# EAGLE design cave (EAGLE 7.7.0)

## Sheet 1 of 5: General
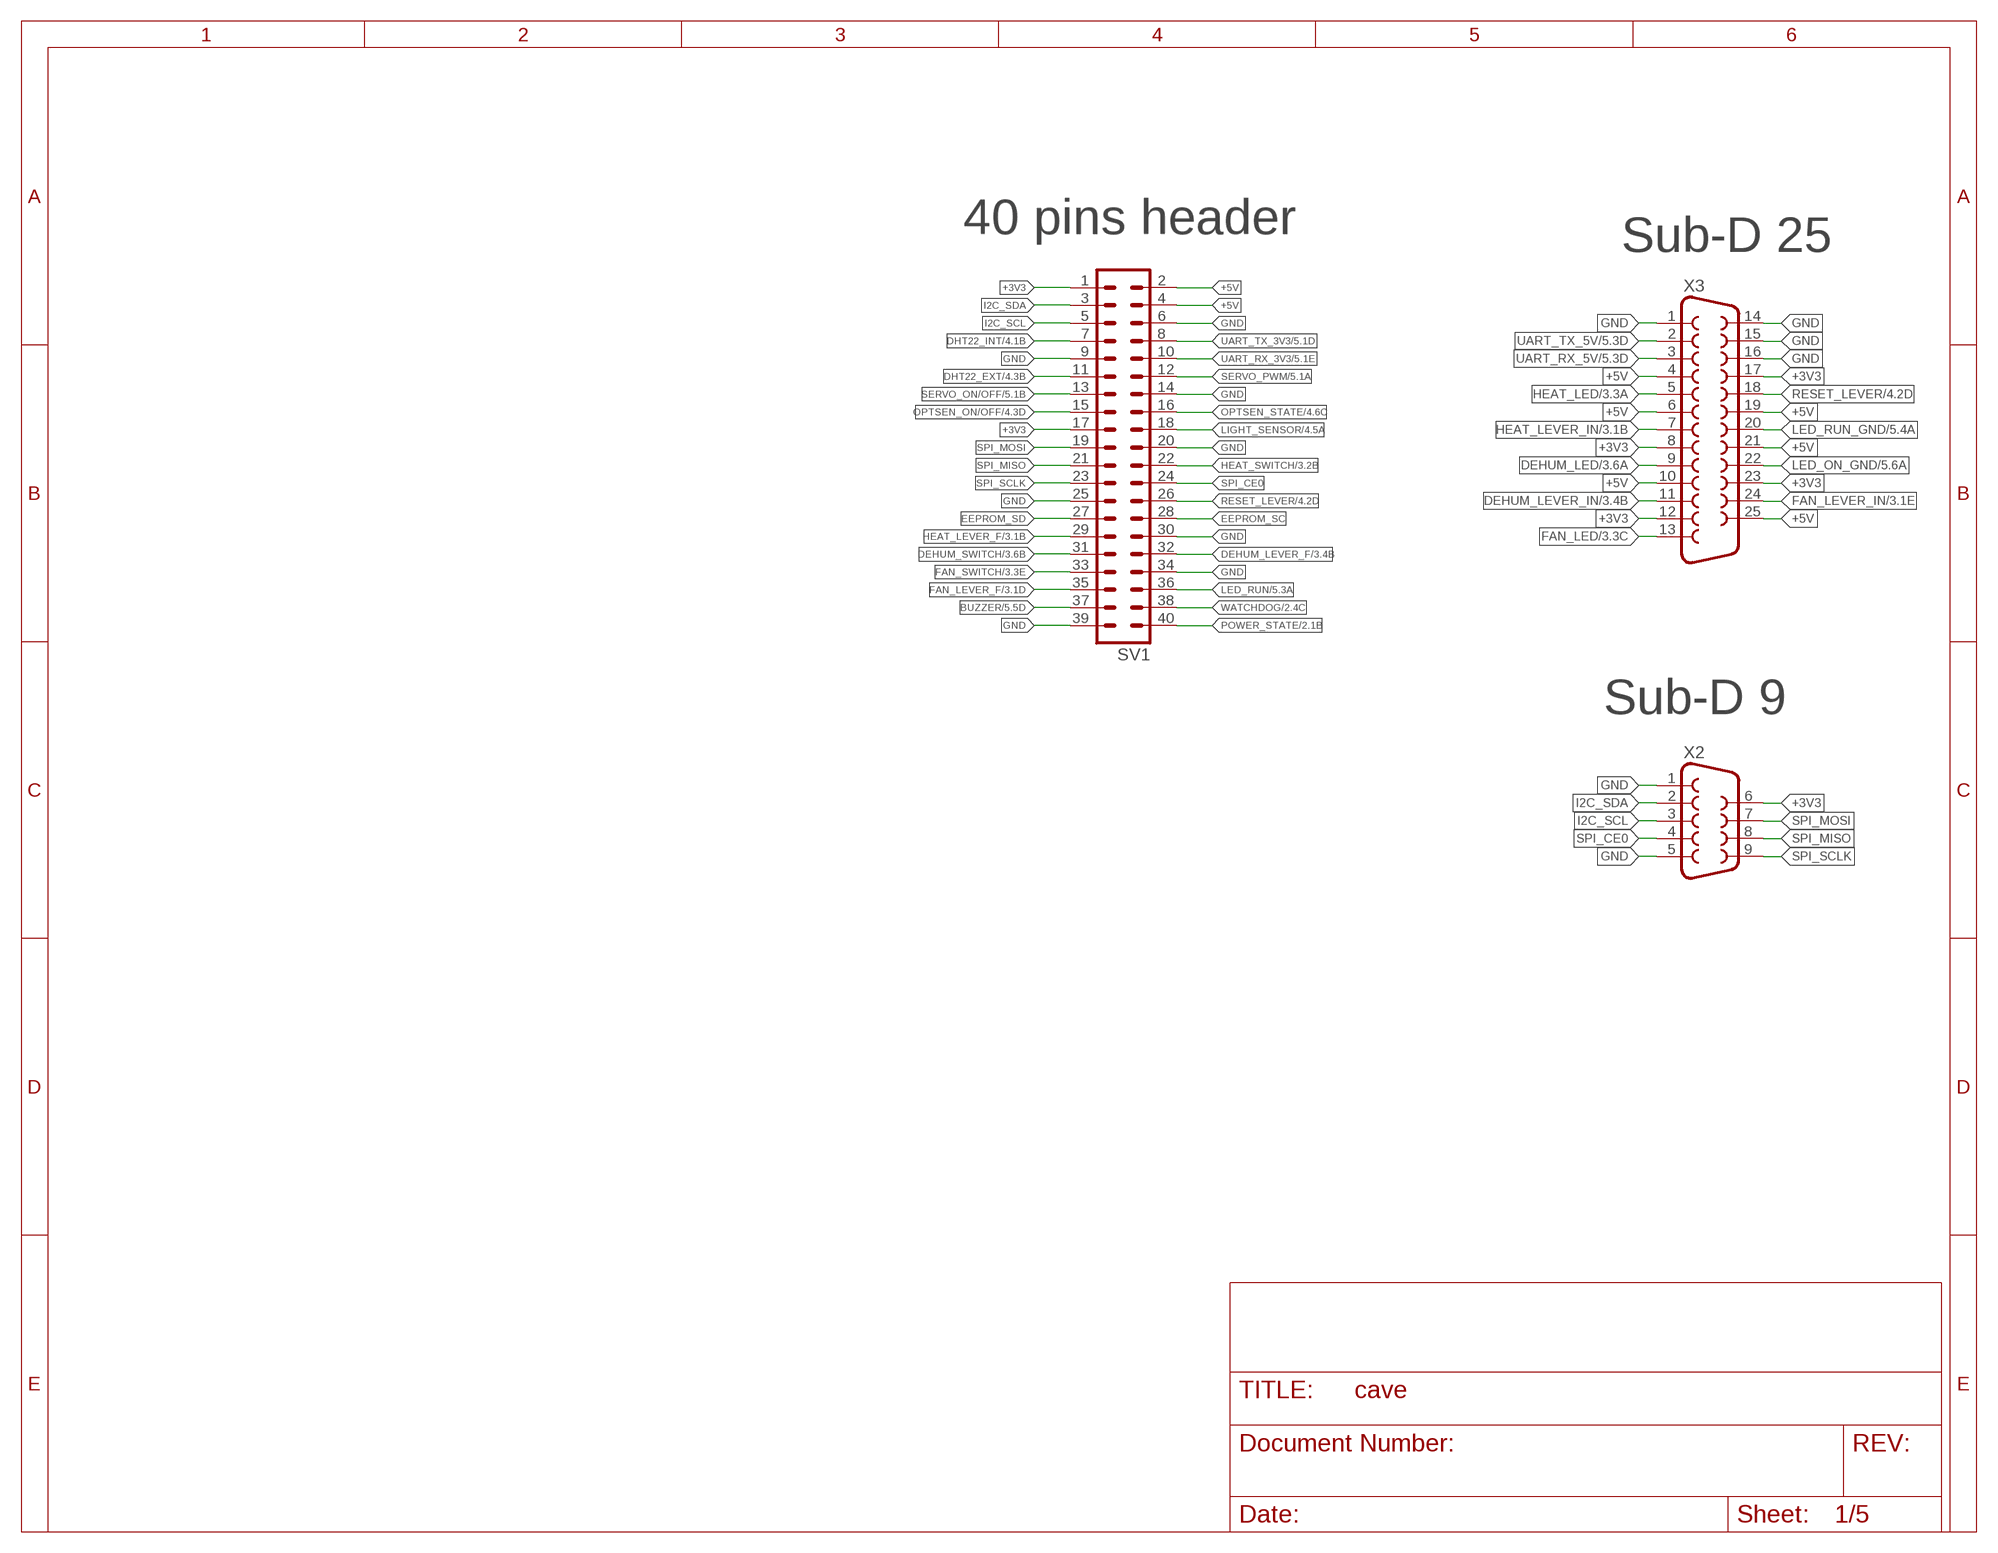
[diagram p0: schematic, sheet 1]

### Parts
SV1  MA20-2  [MA20-2]
X2  F09V  [F09V]
X3  F25V  [F25V]

### Nets
+3V3: SV1.1 SV1.17 X2.6 X3.8 X3.12 X3.17 X3.23 ; also sheet 4,5
+5V: SV1.2 SV1.4 X3.4 X3.6 X3.10 X3.19 X3.21 X3.25 ; also sheet 2,3,4,5
BUZZER: SV1.37 ; also sheet 5
DEHUM_LED: X3.9 ; also sheet 3
DEHUM_LEVER_F: SV1.32 ; also sheet 3
DEHUM_LEVER_IN: X3.11 ; also sheet 3
DEHUM_SWITCH: SV1.31 ; also sheet 3
DHT22_EXT: SV1.11 ; also sheet 4
DHT22_INT: SV1.7 ; also sheet 4
EEPROM_SC: SV1.28
EEPROM_SD: SV1.27
FAN_LED: X3.13 ; also sheet 3
FAN_LEVER_F: SV1.35 ; also sheet 3
FAN_LEVER_IN: X3.24 ; also sheet 3
FAN_SWITCH: SV1.33 ; also sheet 3
GND: SV1.6 SV1.9 SV1.14 SV1.20 SV1.25 SV1.30 SV1.34 SV1.39 X2.1 X2.5 X3.1 X3.14 X3.15 X3.16 ; also sheet 2,3,4,5
HEAT_LED: X3.5 ; also sheet 3
HEAT_LEVER_F: SV1.29 ; also sheet 3
HEAT_LEVER_IN: X3.7 ; also sheet 3
HEAT_SWITCH: SV1.22 ; also sheet 3
I2C_SCL: SV1.5 X2.3
I2C_SDA: SV1.3 X2.2
LED_ON_GND: X3.22 ; also sheet 5
LED_RUN: SV1.36 ; also sheet 5
LED_RUN_GND: X3.20 ; also sheet 5
LIGHT_SENSOR: SV1.18 ; also sheet 4
OPTSEN_ON/OFF: SV1.15 ; also sheet 4
OPTSEN_STATE: SV1.16 ; also sheet 4
POWER_STATE: SV1.40 ; also sheet 2
RESET_LEVER: SV1.26 X3.18 ; also sheet 4
SERVO_ON/OFF: SV1.13 ; also sheet 5
SERVO_PWM: SV1.12 ; also sheet 5
SPI_CE0: SV1.24 X2.4
SPI_MISO: SV1.21 X2.8
SPI_MOSI: SV1.19 X2.7
SPI_SCLK: SV1.23 X2.9
UART_RX_3V3: SV1.10 ; also sheet 5
UART_RX_5V: X3.3 ; also sheet 5
UART_TX_3V3: SV1.8 ; also sheet 5
UART_TX_5V: X3.2 ; also sheet 5
WATCHDOG: SV1.38 ; also sheet 2

### Notes on the sheet
- 40 pins header
- Sub-D 25
- Sub-D 9

## Sheet 2 of 5: Alim
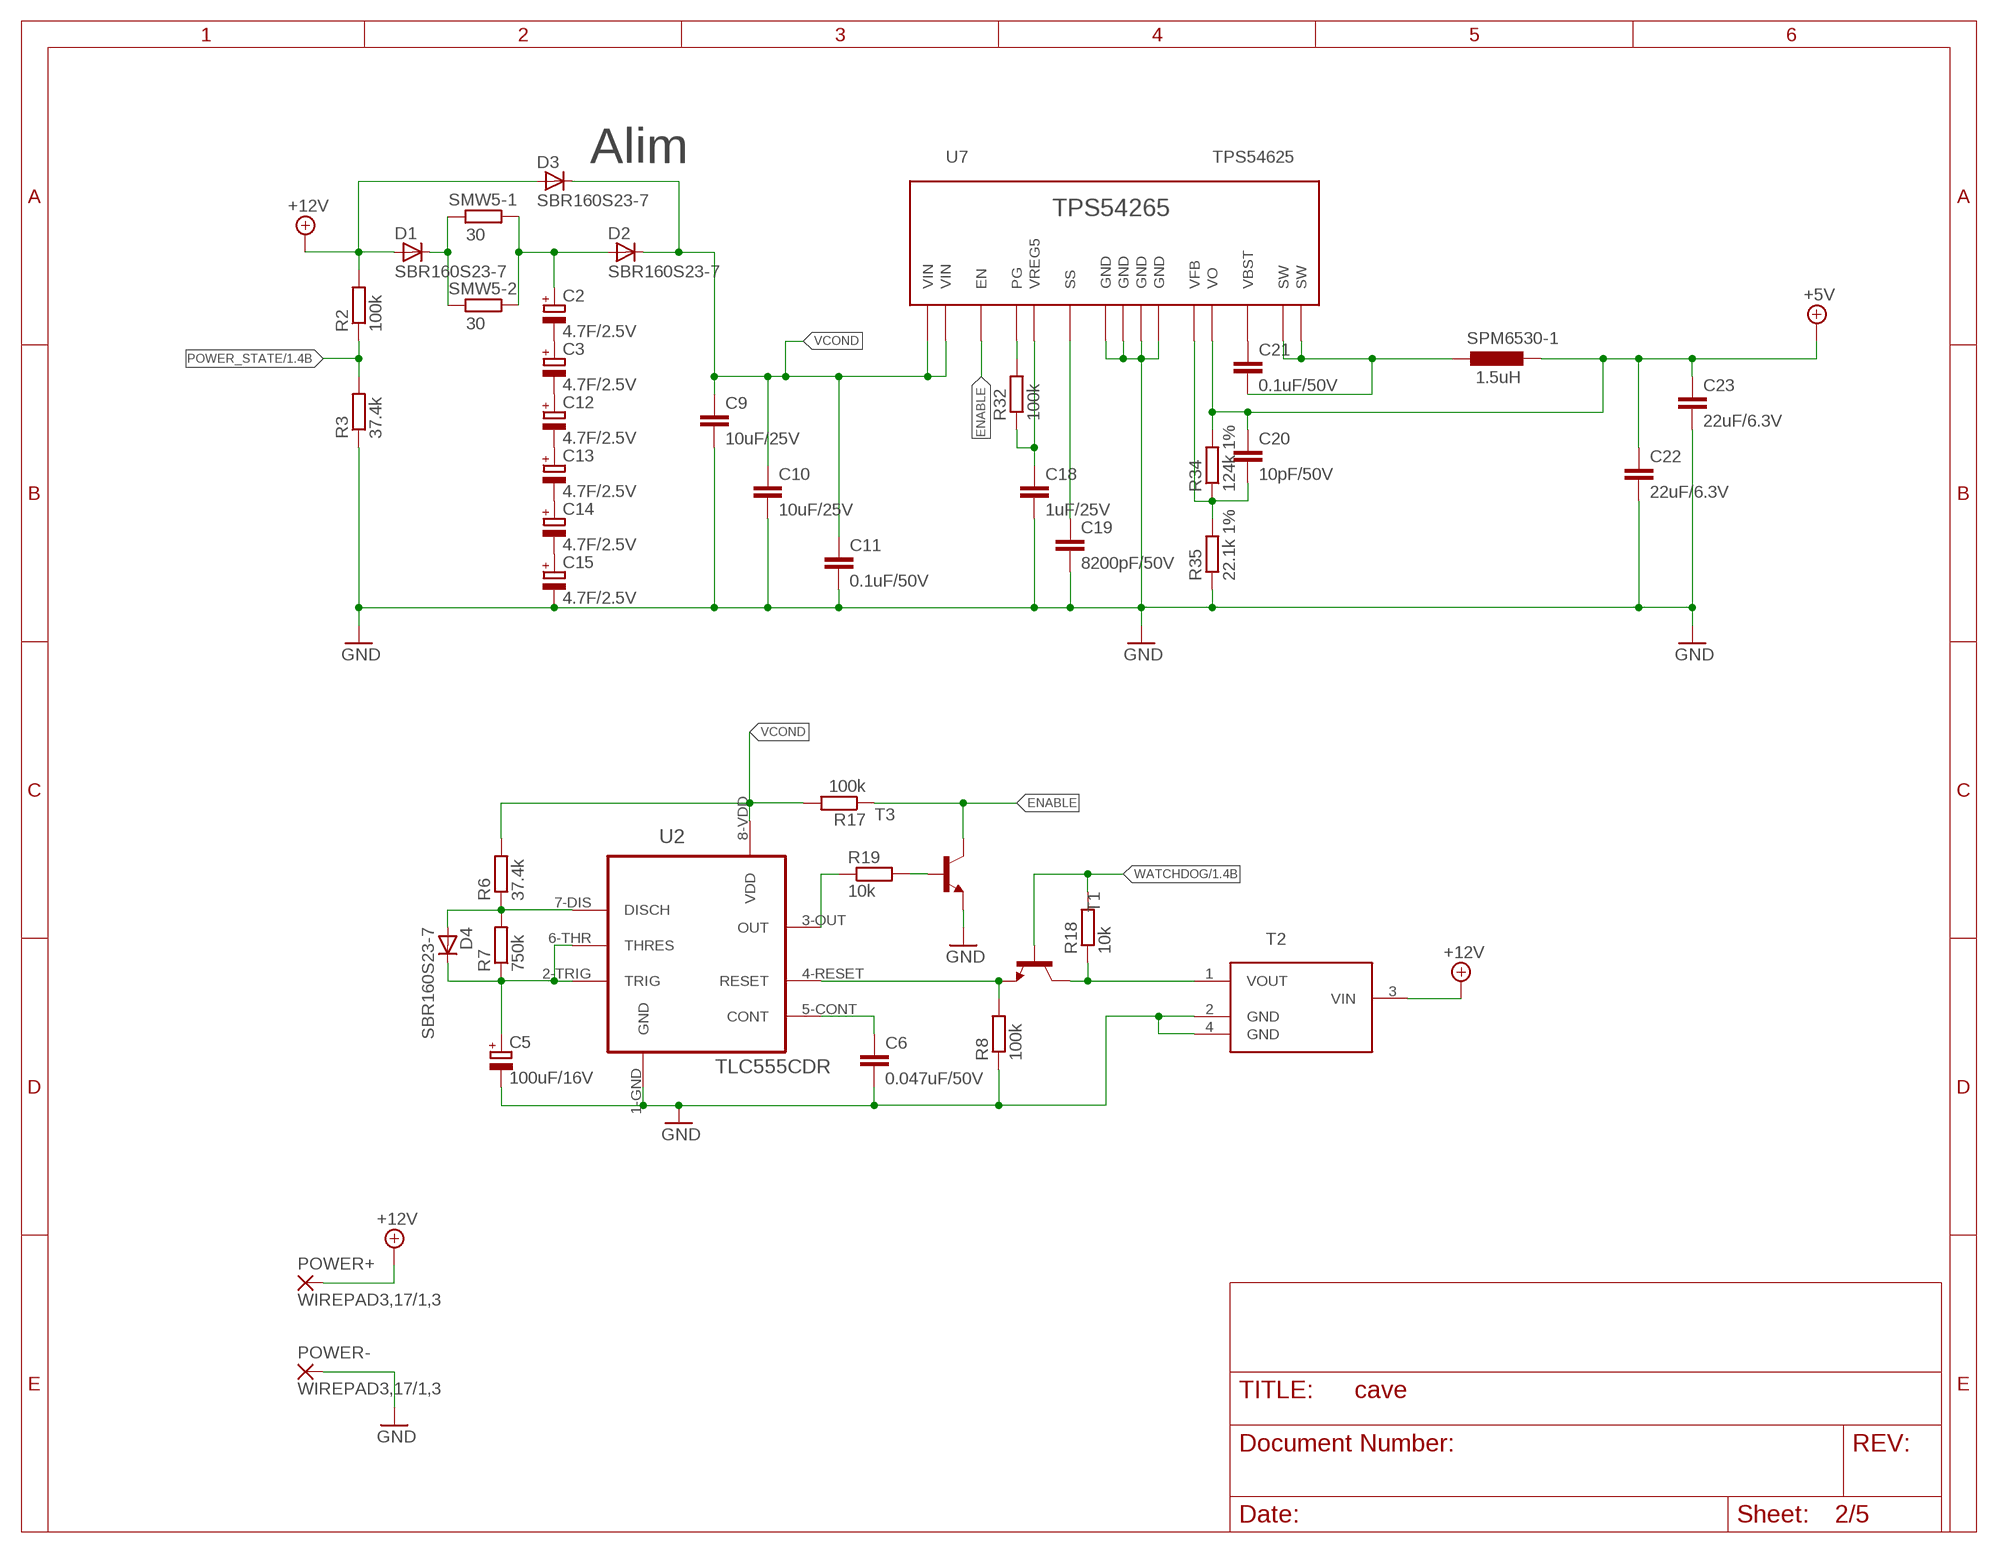
[diagram p1: schematic, sheet 2]

### Parts
C2  4.7F/2.5V  CPOL-EUE5-10.5  [E5-10,5]
C3  4.7F/2.5V  CPOL-EUE5-10.5  [E5-10,5]
C5  100uF/16V  CPOL-EUD/7343-31W  [D/7343-31W]
C6  0.047uF/50V  C-EUC0603  [C0603]
C9  10uF/25V  C-EUC0805  [C0805]
C10  10uF/25V  C-EUC0805  [C0805]
C11  0.1uF/50V  C-EUC0603  [C0603]
C12  4.7F/2.5V  CPOL-EUE5-10.5  [E5-10,5]
C13  4.7F/2.5V  CPOL-EUE5-10.5  [E5-10,5]
C14  4.7F/2.5V  CPOL-EUE5-10.5  [E5-10,5]
C15  4.7F/2.5V  CPOL-EUE5-10.5  [E5-10,5]
C18  1uF/25V  C-EUC0603  [C0603]
C19  8200pF/50V  C-EUC0603  [C0603]
C20  10pF/50V  C-EUC0603  [C0603]
C21  0.1uF/50V  C-EUC0603  [C0603]
C22  22uF/6.3V  C-EUC0805  [C0805]
C23  22uF/6.3V  C-EUC0805  [C0805]
D1  SBR160S23-7  D-A1-C3  [SOT23]
D2  SBR160S23-7  D-A1-C3  [SOT23]
D3  SBR160S23-7  D-A1-C3  [SOT23]
D4  SBR160S23-7  D-A1-C3  [SOT23]
POWER+  WIREPAD3,17/1,3  [3,17/1,3]
POWER-  WIREPAD3,17/1,3  [3,17/1,3]
R2  100k  R-EU_R0603  [R0603]
R3  37.4k  R-EU_R0603  [R0603]
R6  37.4k  R-EU_R0603  [R0603]
R7  750k  R-EU_R0603  [R0603]
R8  100k  R-EU_R0603  [R0603]
R17  100k  R-EU_R0603  [R0603]
R18  10k  R-EU_R0603  [R0603]
R19  10k  R-EU_R0603  [R0603]
R32  100k  R-EU_R0603  [R0603]
R34  124k 1%  R-EU_R0603  [R0603]
R35  22.1k 1%  R-EU_R0603  [R0603]
SMW5-1  30  SMW530RJT  [SM_5]
SMW5-2  30  SMW530RJT  [SM_5]
SPM6530-1  1.5uH  SPM6530  [6530]
T1  MMBT2369LT1-NPN-SOT23-BEC  [SOT23-BEC]
T2  L78L33ACUTR  [SOT150P400X160-4N]
T3  MMBT2369LT1-NPN-SOT23-BEC  [SOT23-BEC]
U2  TLC555CDR  [SOIC127P600X175-8N]
U7  TPS54625  [HTSSOP-14]

### Nets
+5V: C20.1 C22.1 C23.1 R34.2 SPM6530-1.P$2 U7.P$1(VO) ; also sheet 1,3,4,5
+12V: D1.1(A) D3.1(A) POWER+.1(P) R2.2 T2.3(VIN) ; also sheet 3,5
ENABLE: R17.1 T3.C U7.P$7(EN)
GND: C5.- C6.2 C9.2 C10.2 C11.2 C15.- C18.2 C19.2 C22.2 C23.2 POWER-.1(P) R3.1 R8.1 R35.1 T2.2(GND) T2.4(GND) T3.E U2.1-GND(GND) U7.P$5(GND) U7.P$8(GND) U7.P$9(GND) U7.P$15(GND) ; also sheet 1,3,4,5
N$1: C2.+ D2.1(A) SMW5-1.P$2 SMW5-2.P$2
N$2: C2.- C3.+
N$3: C3.- C12.+
N$4: D1.3(C) SMW5-1.P$1 SMW5-2.P$1
N$5: D4.1(A) R6.1 R7.2 U2.7-DIS(DISCH)
N$6: C5.+ D4.3(C) R7.1 U2.2-TRIG(TRIG) U2.6-THR(THRES)
N$8: C12.- C13.+
N$9: C6.1 U2.5-CONT(CONT)
N$11: R18.1 T1.C T2.1(VOUT)
N$12: R8.2 T1.E U2.4-RESET(RESET)
N$16: R19.1 U2.3-OUT(OUT)
N$17: R19.2 T3.B
N$18: C13.- C14.+
N$19: C14.- C15.+
N$28: C18.1 R32.1 U7.P$3(VREG5)
N$30: R32.2 U7.P$6(PG)
N$31: C19.1 U7.P$4(SS)
N$34: C20.2 R34.1 R35.2 U7.P$2(VFB)
N$35: C21.1 U7.P$12(VBST)
N$36: C21.2 SPM6530-1.P$1 U7.P$10(SW) U7.P$11(SW)
POWER_STATE: R2.1 R3.2 ; also sheet 1
VCOND: C9.1 C10.1 C11.1 D2.3(C) D3.3(C) R6.2 R17.2 U2.8-VDD(VDD) U7.P$13(VIN) U7.P$14(VIN)
WATCHDOG: R18.2 T1.B ; also sheet 1

### Notes on the sheet
- Alim

## Sheet 3 of 5: Switches
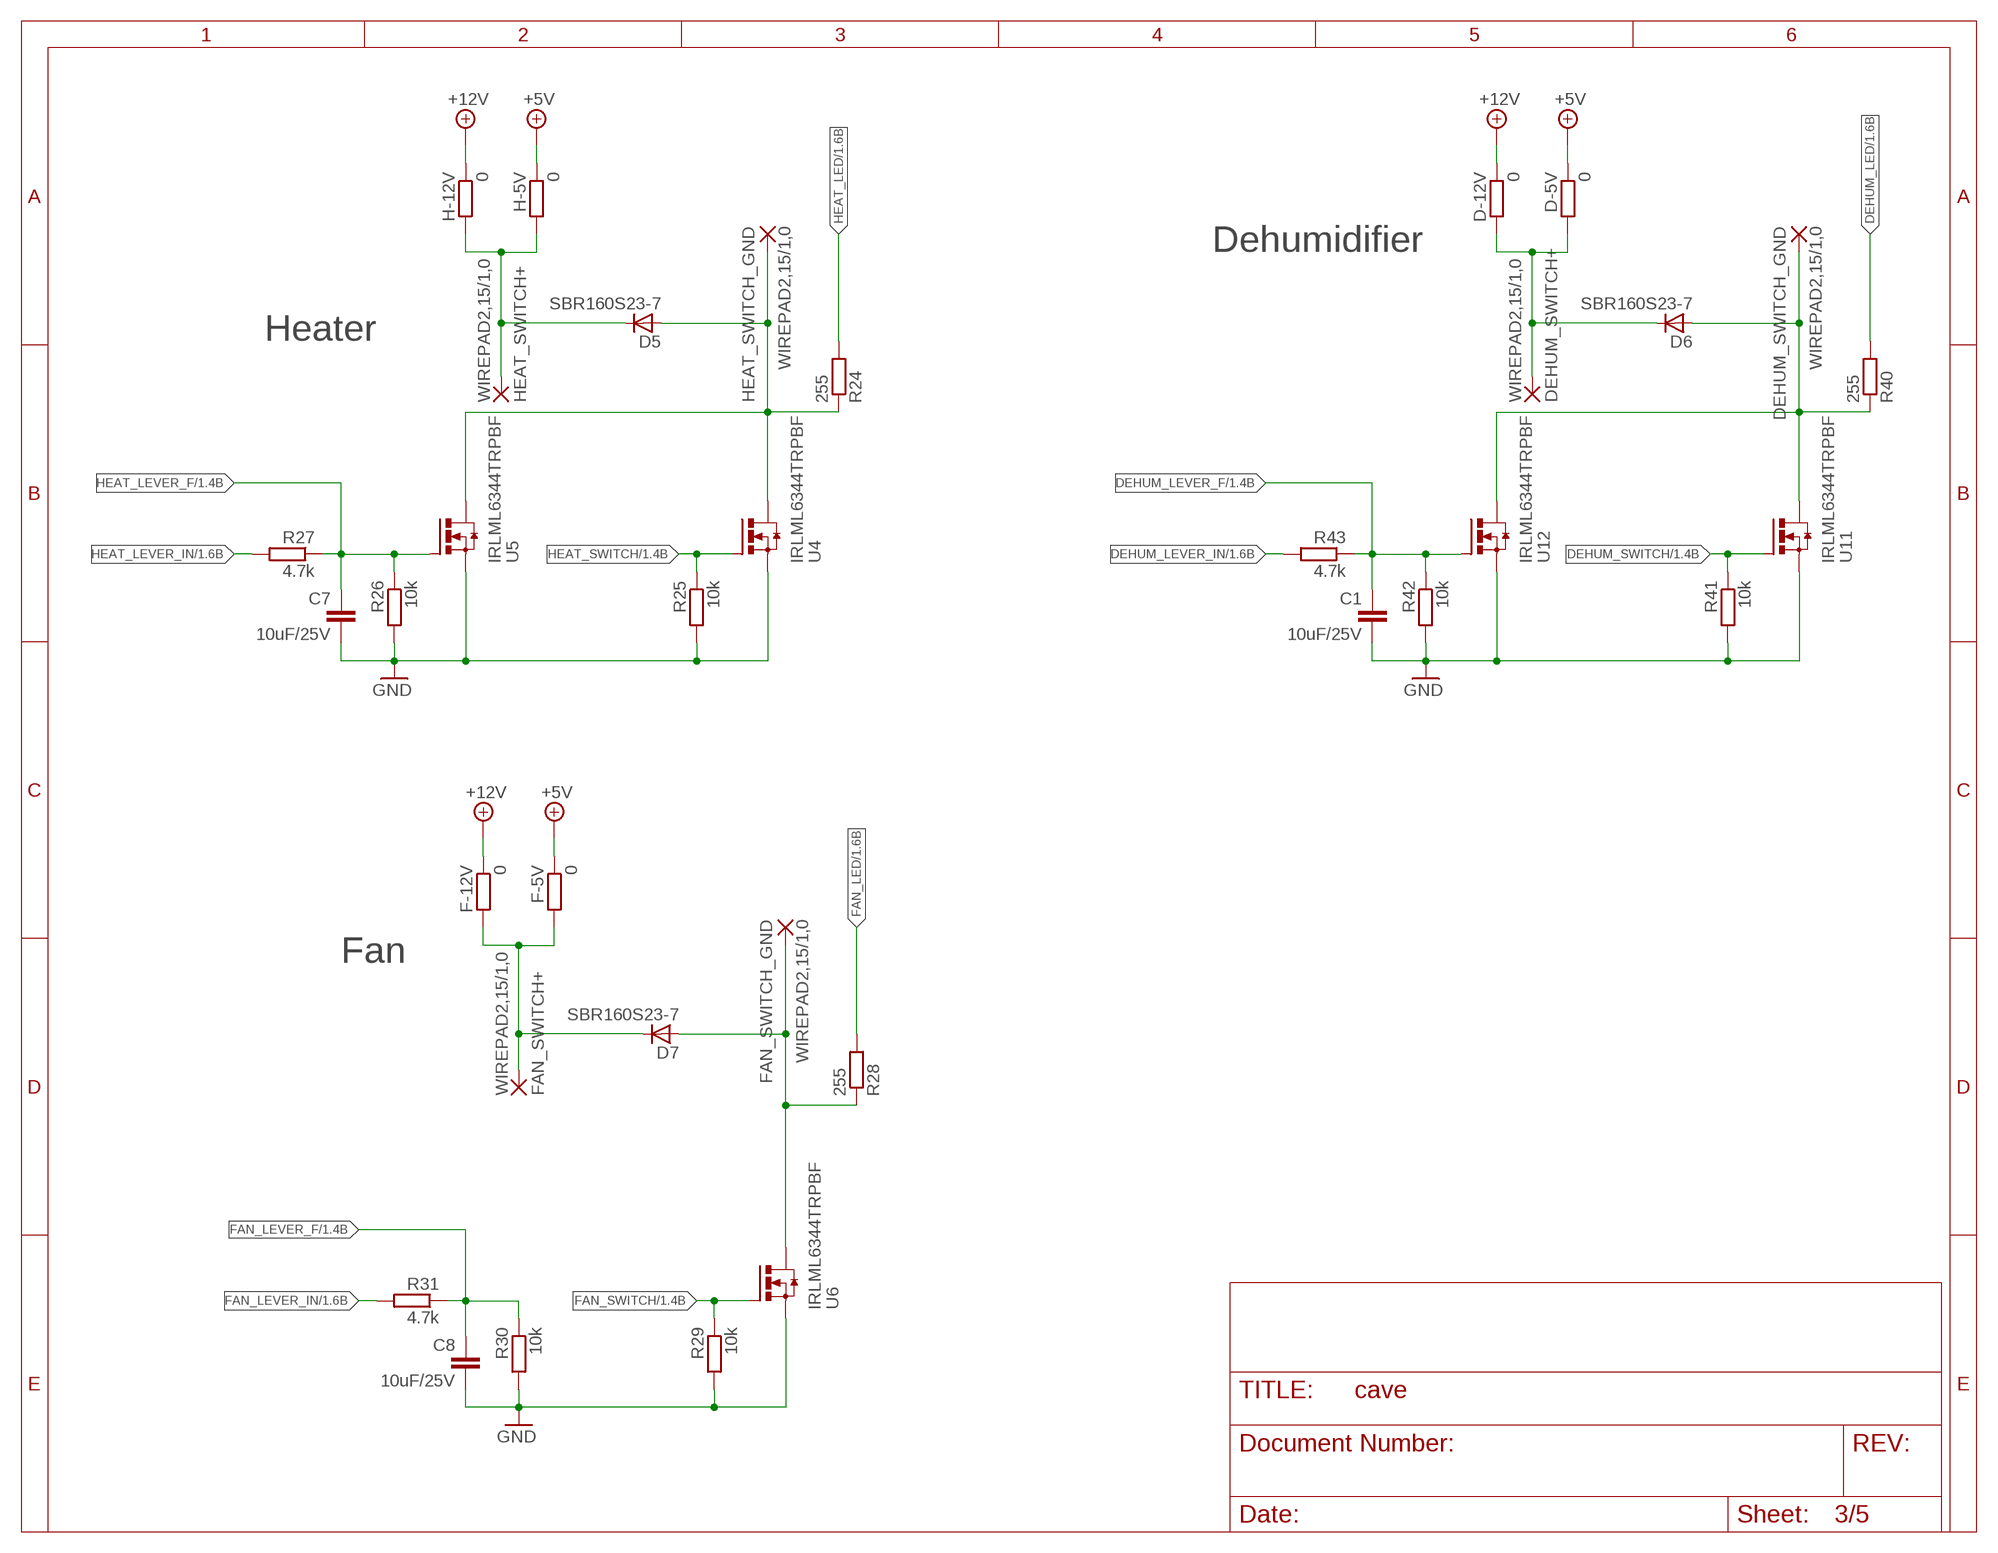
[diagram p2: schematic, sheet 3]

### Parts
C1  10uF/25V  C-EUC0805  [C0805]
C7  10uF/25V  C-EUC0805  [C0805]
C8  10uF/25V  C-EUC0805  [C0805]
D5  SBR160S23-7  D-A1-C3  [SOT23]
D6  SBR160S23-7  D-A1-C3  [SOT23]
D7  SBR160S23-7  D-A1-C3  [SOT23]
D-5V  0  R-EU_R0805  [R0805]
D-12V  0  R-EU_R0805  [R0805]
DEHUM_SWITCH+  WIREPAD2,15/1,0  [2,15/1,0]
DEHUM_SWITCH_GND  WIREPAD2,15/1,0  [2,15/1,0]
F-5V  0  R-EU_R0805  [R0805]
F-12V  0  R-EU_R0805  [R0805]
FAN_SWITCH+  WIREPAD2,15/1,0  [2,15/1,0]
FAN_SWITCH_GND  WIREPAD2,15/1,0  [2,15/1,0]
H-5V  0  R-EU_R0805  [R0805]
H-12V  0  R-EU_R0805  [R0805]
HEAT_SWITCH+  WIREPAD2,15/1,0  [2,15/1,0]
HEAT_SWITCH_GND  WIREPAD2,15/1,0  [2,15/1,0]
R24  255  R-EU_R0805  [R0805]
R25  10k  R-EU_R0603  [R0603]
R26  10k  R-EU_R0603  [R0603]
R27  4.7k  R-EU_R0603  [R0603]
R28  255  R-EU_R0805  [R0805]
R29  10k  R-EU_R0603  [R0603]
R30  10k  R-EU_R0603  [R0603]
R31  4.7k  R-EU_R0603  [R0603]
R40  255  R-EU_R0805  [R0805]
R41  10k  R-EU_R0603  [R0603]
R42  10k  R-EU_R0603  [R0603]
R43  4.7k  R-EU_R0603  [R0603]
U4  IRLML6344TRPBF  [SOT95P240X112-3N]
U5  IRLML6344TRPBF  [SOT95P240X112-3N]
U6  IRLML6344TRPBF  [SOT95P240X112-3N]
U11  IRLML6344TRPBF  [SOT95P240X112-3N]
U12  IRLML6344TRPBF  [SOT95P240X112-3N]

### Nets
+5V: D-5V.1 F-5V.1 H-5V.1 ; also sheet 1,2,4,5
+12V: D-12V.1 F-12V.1 H-12V.1 ; also sheet 2,5
DEHUM_GND: D6.1(A) DEHUM_SWITCH_GND.1(P) R40.1 U11.3(D) U12.3(D)
DEHUM_LED: R40.2 ; also sheet 1
DEHUM_LEVER_F: C1.1 R42.1 R43.1 U12.1(G) ; also sheet 1
DEHUM_LEVER_IN: R43.2 ; also sheet 1
DEHUM_SWITCH: R41.1 U11.1(G) ; also sheet 1
FAN_GND: D7.1(A) FAN_SWITCH_GND.1(P) R28.1 U6.3(D)
FAN_LED: R28.2 ; also sheet 1
FAN_LEVER_F: C8.1 R30.1 R31.1 ; also sheet 1
FAN_LEVER_IN: R31.2 ; also sheet 1
FAN_SWITCH: R29.1 U6.1(G) ; also sheet 1
GND: C1.2 C7.2 C8.2 R25.2 R26.2 R29.2 R30.2 R41.2 R42.2 U4.2(S) U5.2(S) U6.2(S) U11.2(S) U12.2(S) ; also sheet 1,2,4,5
HEAT_GND: D5.1(A) HEAT_SWITCH_GND.1(P) R24.1 U4.3(D) U5.3(D)
HEAT_LED: R24.2 ; also sheet 1
HEAT_LEVER_F: C7.1 R26.1 R27.1 U5.1(G) ; also sheet 1
HEAT_LEVER_IN: R27.2 ; also sheet 1
HEAT_SWITCH: R25.1 U4.1(G) ; also sheet 1
N$22: D7.3(C) F-5V.2 F-12V.2 FAN_SWITCH+.1(P)
N$26: D5.3(C) H-5V.2 H-12V.2 HEAT_SWITCH+.1(P)
N$27: D6.3(C) D-5V.2 D-12V.2 DEHUM_SWITCH+.1(P)

### Notes on the sheet
- Dehumidifier
- Heater
- Fan

## Sheet 4 of 5: Sensors
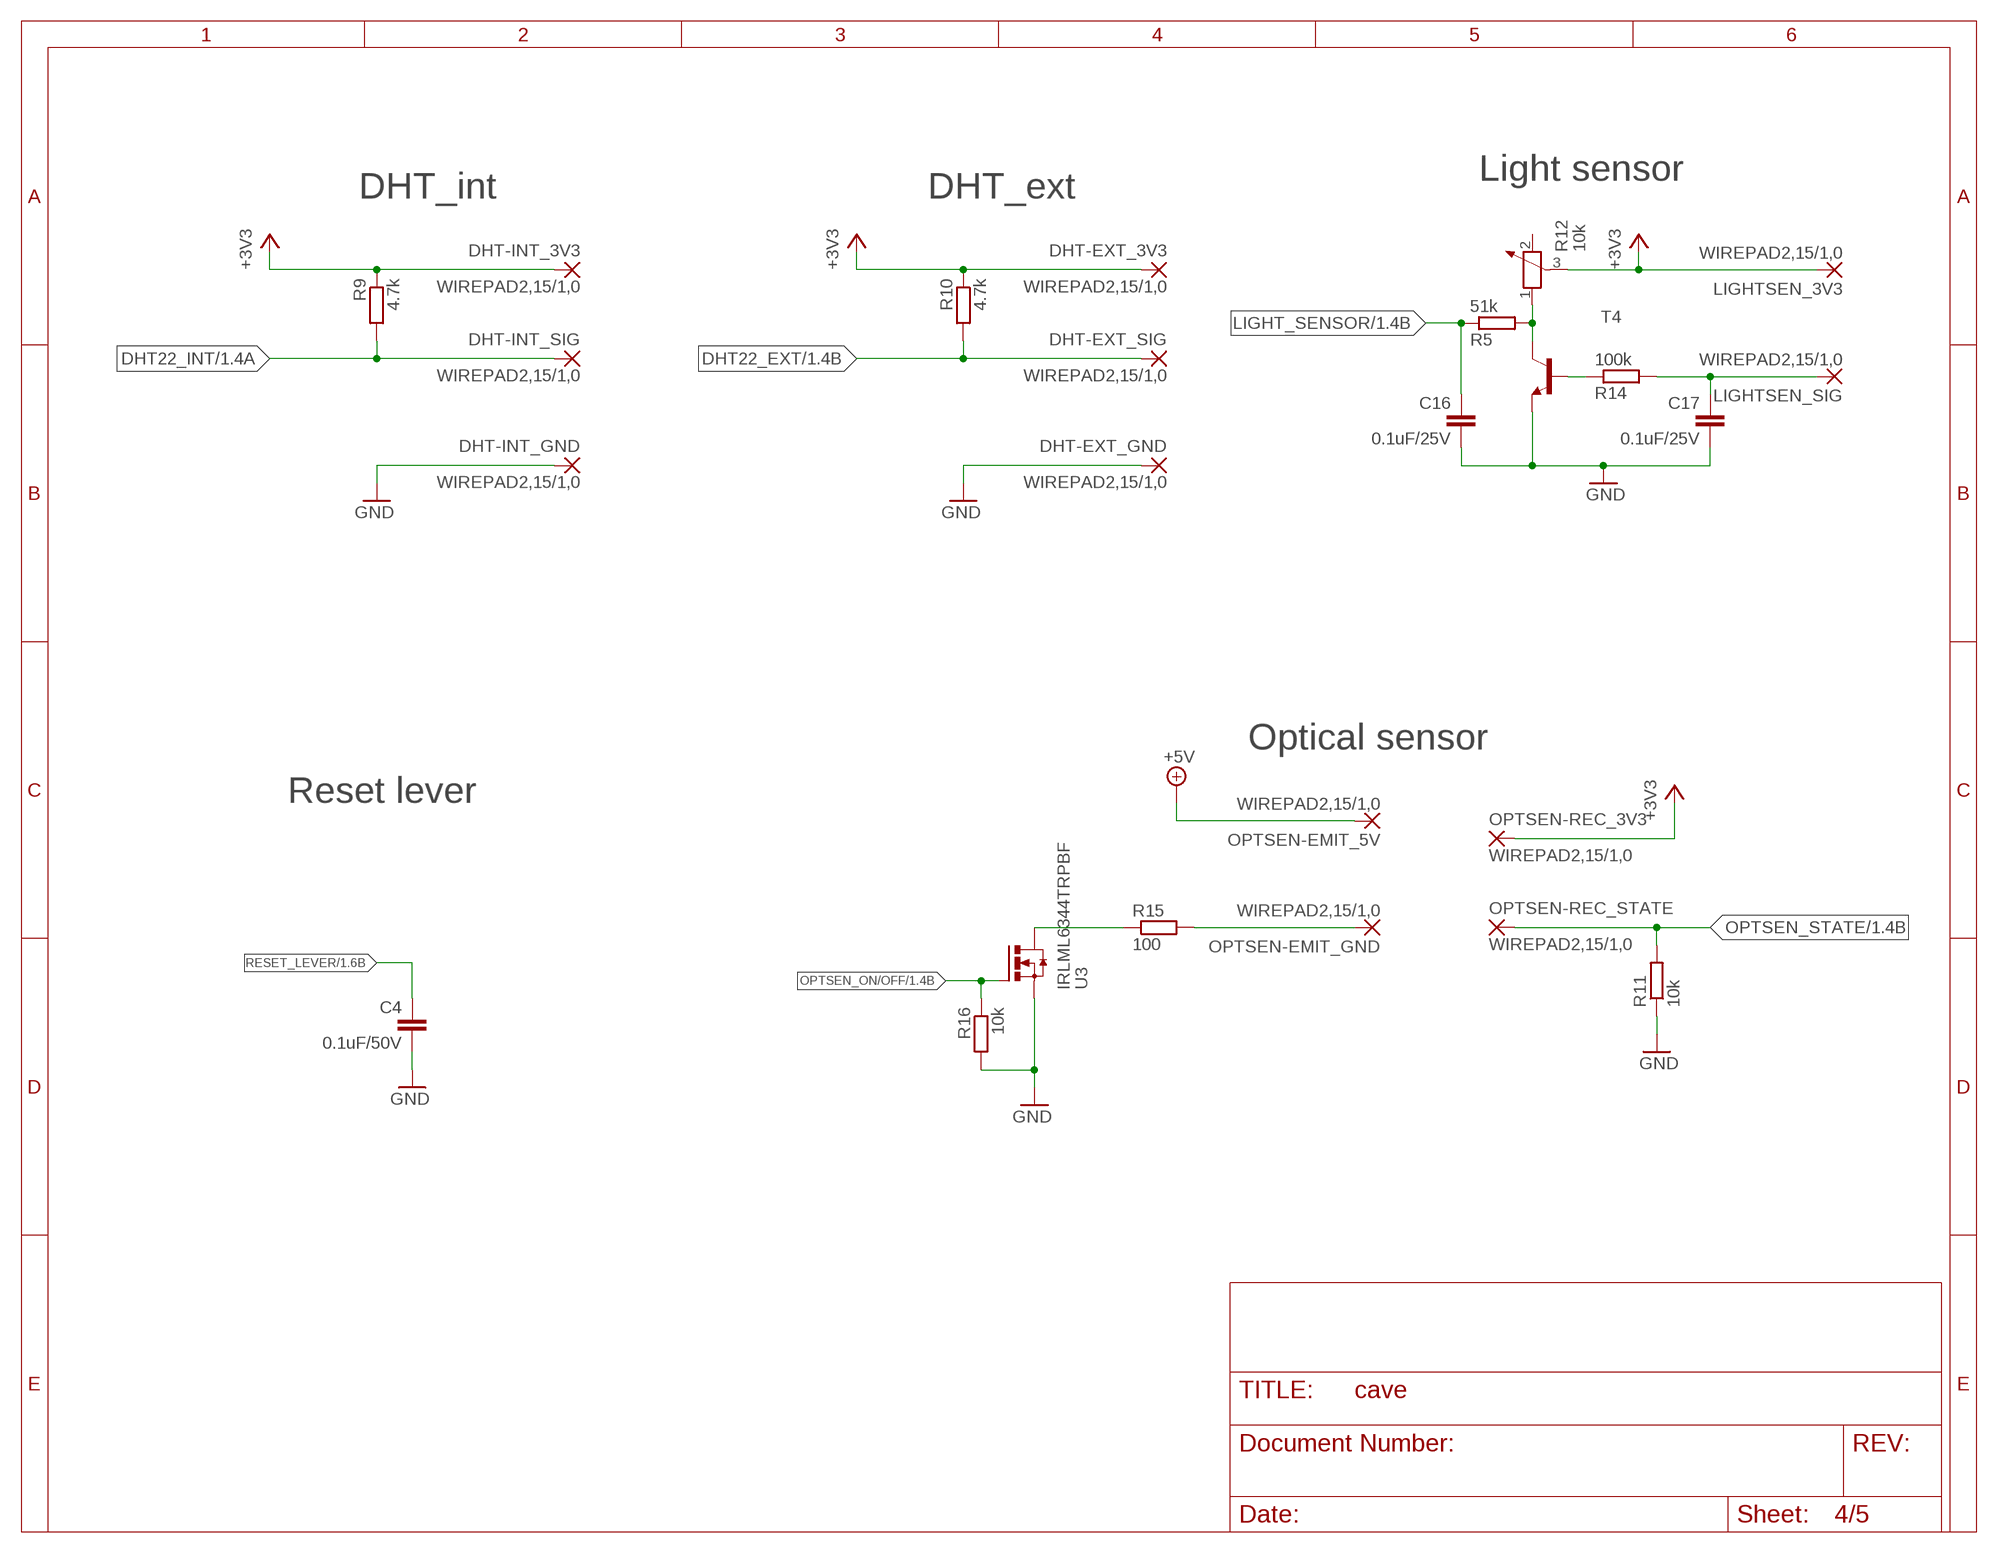
[diagram p3: schematic, sheet 4]

### Parts
C4  0.1uF/50V  C-EUC0603  [C0603]
C16  0.1uF/25V  C-EUC0603  [C0603]
C17  0.1uF/25V  C-EUC0603  [C0603]
DHT-EXT_3V3  WIREPAD2,15/1,0  [2,15/1,0]
DHT-EXT_GND  WIREPAD2,15/1,0  [2,15/1,0]
DHT-EXT_SIG  WIREPAD2,15/1,0  [2,15/1,0]
DHT-INT_3V3  WIREPAD2,15/1,0  [2,15/1,0]
DHT-INT_GND  WIREPAD2,15/1,0  [2,15/1,0]
DHT-INT_SIG  WIREPAD2,15/1,0  [2,15/1,0]
LIGHTSEN_3V3  WIREPAD2,15/1,0  [2,15/1,0]
LIGHTSEN_SIG  WIREPAD2,15/1,0  [2,15/1,0]
OPTSEN-EMIT_5V  WIREPAD2,15/1,0  [2,15/1,0]
OPTSEN-EMIT_GND  WIREPAD2,15/1,0  [2,15/1,0]
OPTSEN-REC_3V3  WIREPAD2,15/1,0  [2,15/1,0]
OPTSEN-REC_STATE  WIREPAD2,15/1,0  [2,15/1,0]
R5  51k  R-EU_R0603  [R0603]
R9  4.7k  R-EU_R0603  [R0603]
R10  4.7k  R-EU_R0603  [R0603]
R11  10k  R-EU_R0603  [R0603]
R12  10k  POTENTIOMETER_PT_SPIN  [PT-SPIN]
R14  100k  R-EU_R0603  [R0603]
R15  100  R-EU_R0805  [R0805]
R16  10k  R-EU_R0603  [R0603]
T4  MMBT2369LT1-NPN-SOT23-BEC  [SOT23-BEC]
U3  IRLML6344TRPBF  [SOT95P240X112-3N]

### Nets
+3V3: DHT-EXT_3V3.1(P) DHT-INT_3V3.1(P) LIGHTSEN_3V3.1(P) OPTSEN-REC_3V3.1(P) R9.1 R10.1 R12.3 ; also sheet 1,5
+5V: OPTSEN-EMIT_5V.1(P) ; also sheet 1,2,3,5
DHT22_EXT: DHT-EXT_SIG.1(P) R10.2 ; also sheet 1
DHT22_INT: DHT-INT_SIG.1(P) R9.2 ; also sheet 1
GND: C4.2 C16.2 C17.2 DHT-EXT_GND.1(P) DHT-INT_GND.1(P) R11.1 R16.2 T4.E U3.2(S) ; also sheet 1,2,3,5
LIGHT_SENSOR: C16.1 R5.1 ; also sheet 1
LIGHT_SENSOR_UNFILTERED: R5.2 R12.1 T4.C
N$14: OPTSEN-EMIT_GND.1(P) R15.2
N$15: R15.1 U3.3(D)
N$20: R14.1 T4.B
N$21: C17.1 LIGHTSEN_SIG.1(P) R14.2
OPTSEN_ON/OFF: R16.1 U3.1(G) ; also sheet 1
OPTSEN_STATE: OPTSEN-REC_STATE.1(P) R11.2 ; also sheet 1
RESET_LEVER: C4.1 ; also sheet 1
Unconnected: R12.2

### Notes on the sheet
- Light sensor
- DHT_int | DHT_ext
- Optical sensor
- Reset lever

## Sheet 5 of 5: Outputs
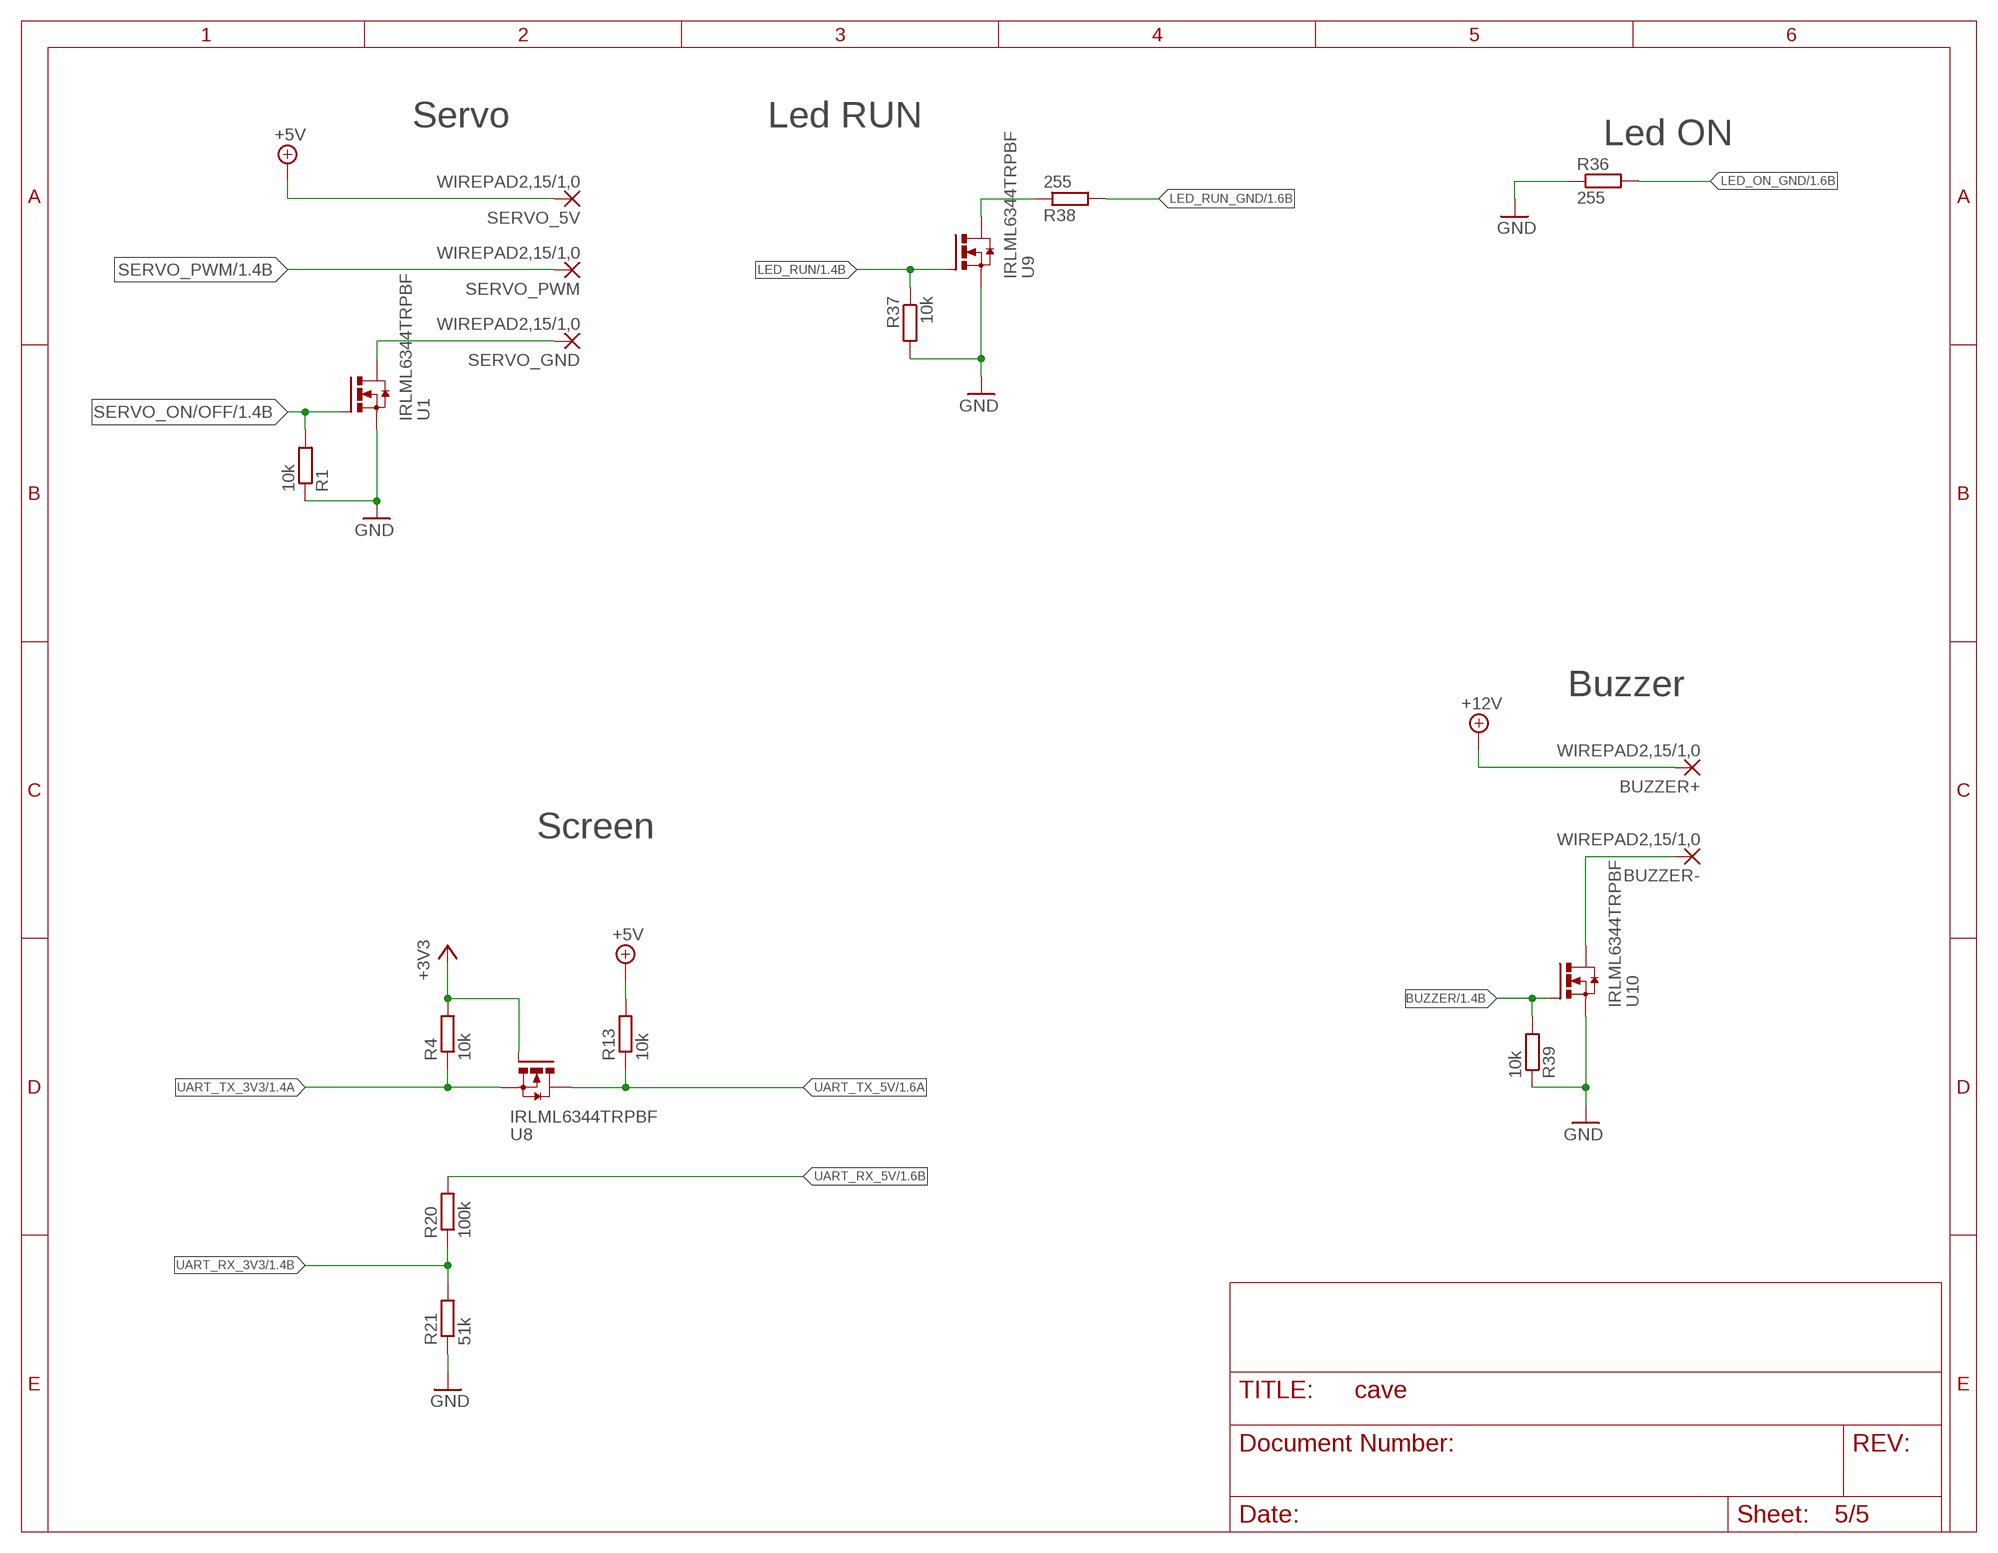
[diagram p4: schematic, sheet 5]

### Parts
BUZZER+  WIREPAD2,15/1,0  [2,15/1,0]
BUZZER-  WIREPAD2,15/1,0  [2,15/1,0]
R1  10k  R-EU_R0603  [R0603]
R4  10k  R-EU_R0603  [R0603]
R13  10k  R-EU_R0603  [R0603]
R20  100k  R-EU_R0603  [R0603]
R21  51k  R-EU_R0603  [R0603]
R36  255  R-EU_R0805  [R0805]
R37  10k  R-EU_R0603  [R0603]
R38  255  R-EU_R0805  [R0805]
R39  10k  R-EU_R0603  [R0603]
SERVO_5V  WIREPAD2,15/1,0  [2,15/1,0]
SERVO_GND  WIREPAD2,15/1,0  [2,15/1,0]
SERVO_PWM  WIREPAD2,15/1,0  [2,15/1,0]
U1  IRLML6344TRPBF  [SOT95P240X112-3N]
U8  IRLML6344TRPBF  [SOT95P240X112-3N]
U9  IRLML6344TRPBF  [SOT95P240X112-3N]
U10  IRLML6344TRPBF  [SOT95P240X112-3N]

### Nets
+3V3: R4.2 U8.1(G) ; also sheet 1,4
+5V: R13.2 SERVO_5V.1(P) ; also sheet 1,2,3,4
+12V: BUZZER+.1(P) ; also sheet 2,3
BUZZER: R39.2 U10.1(G) ; also sheet 1
GND: R1.1 R21.1 R36.1 R37.2 R39.1 U1.2(S) U9.2(S) U10.2(S) ; also sheet 1,2,3,4
LED_ON_GND: R36.2 ; also sheet 1
LED_RUN: R37.1 U9.1(G) ; also sheet 1
LED_RUN_GND: R38.2 ; also sheet 1
N$7: SERVO_GND.1(P) U1.3(D)
N$10: BUZZER-.1(P) U10.3(D)
N$25: R38.1 U9.3(D)
SERVO_ON/OFF: R1.2 U1.1(G) ; also sheet 1
SERVO_PWM: SERVO_PWM.1(P) ; also sheet 1
UART_RX_3V3: R20.1 R21.2 ; also sheet 1
UART_RX_5V: R20.2 ; also sheet 1
UART_TX_3V3: R4.1 U8.2(S) ; also sheet 1
UART_TX_5V: R13.1 U8.3(D) ; also sheet 1

### Notes on the sheet
- Servo | Led RUN
- Led ON
- Buzzer
- Screen

## Library data of the parts
BUZZER+ BUZZER- DEHUM_SWITCH+ DEHUM_SWITCH_GND DHT-EXT_3V3 DHT-EXT_GND DHT-EXT_SIG DHT-INT_3V3 DHT-INT_GND DHT-INT_SIG FAN_SWITCH+ FAN_SWITCH_GND HEAT_SWITCH+ HEAT_SWITCH_GND LIGHTSEN_3V3 LIGHTSEN_SIG OPTSEN-EMIT_5V OPTSEN-EMIT_GND OPTSEN-REC_3V3 OPTSEN-REC_STATE POWER+ POWER- SERVO_5V SERVO_GND SERVO_PWM = wirepad:WIREPAD: Wire PAD connect wire on PCB
C1 C4 C6-C11 C16-C23 = rcl:C-EU: CAPACITOR, European symbol
C2 C3 C12-C15 = rcl:CPOL-EU: POLARIZED CAPACITOR, European symbol
C5 = resistor:CPOL-EU: POLARIZED CAPACITOR, European symbol
D1-D7 = semicon-smd-ipc:D-: DIODE unfilled
D-5V D-12V F-5V F-12V H-5V H-12V R1-R11 R13-R21 R24-R32 R34-R43 = rcl:R-EU_: RESISTOR, European symbol
R12 = rcl:POTENTIOMETER_: Potentiometer
SMW5-1 SMW5-2 = SMW:SMW530RJT
SPM6530-1 = SPM_inductor:SPM6530
SV1 = HE_254:MA20-2: PIN HEADER; OC_FARNELL: unknown; OC_NEWARK: unknown
T1 T3 T4 = transistor:*-NPN-: NPN Transistror BF959 corrected 2008.03.06
T2 = STM-STM8S003_L78LxxUTR:L78L: Positive voltage regulators(Output current up to 100 mA and Output voltages of 3.3; 5; 6; 8; 9; 10; 12; 15; 18;24 V); MPN: L78L33ACUTR; OC_FARNELL: 2253467; OC_NEWARK: 89K1361; PACKAGE: SOT-89; SUPPLIER: STMicroelectronics
U1 U3-U6 U8-U12 = transistor-power:IRLML6344TRPBF: Power MOSFET; MPN: IRLML6344TRPBF; OC_FARNELL: 1857299; OC_NEWARK: 25T5501; PACKAGE: SOT-23-3; SUPPLIER: INTERNATIONAL RECTIFIER
U2 = TLC555CDR:TLC555CDR: TIMER; MPN: TLC555CDR; OC_FARNELL: 8454426; OC_NEWARK: 35C2153; PACKAGE: SOIC-8; SUPPLIER: TI
U7 = TPS54625:TPS54625
X2 = con-subd:F09: SUB-D; OC_FARNELL: unknown; OC_NEWARK: unknown
X3 = con-subd:F25: SUB-D; OC_FARNELL: unknown; OC_NEWARK: unknown

## Board
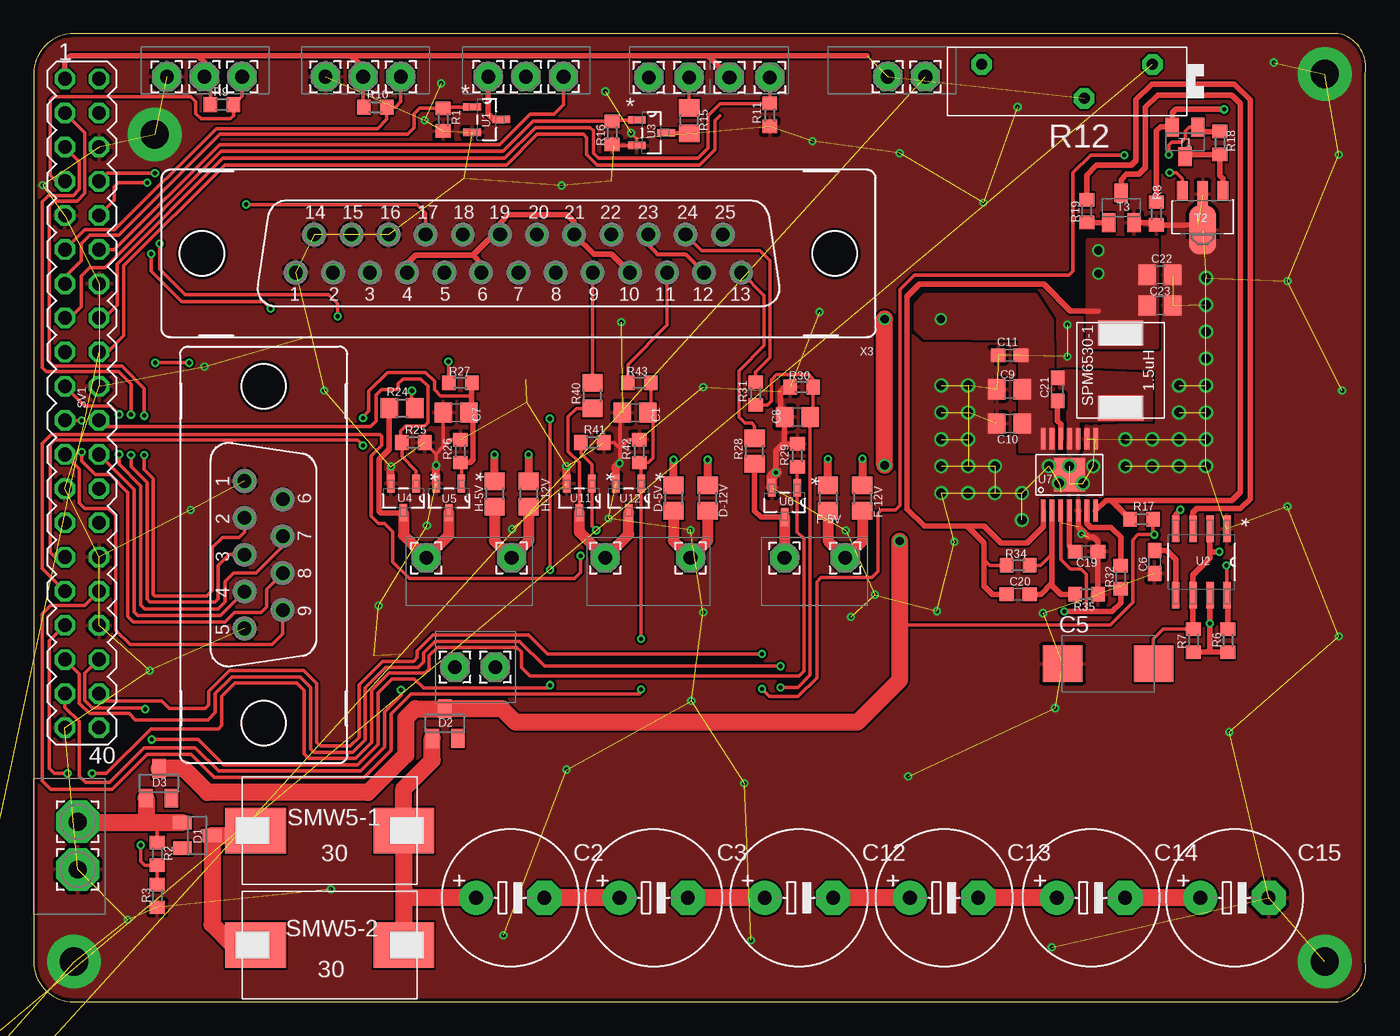
[diagram p5: board, top side]
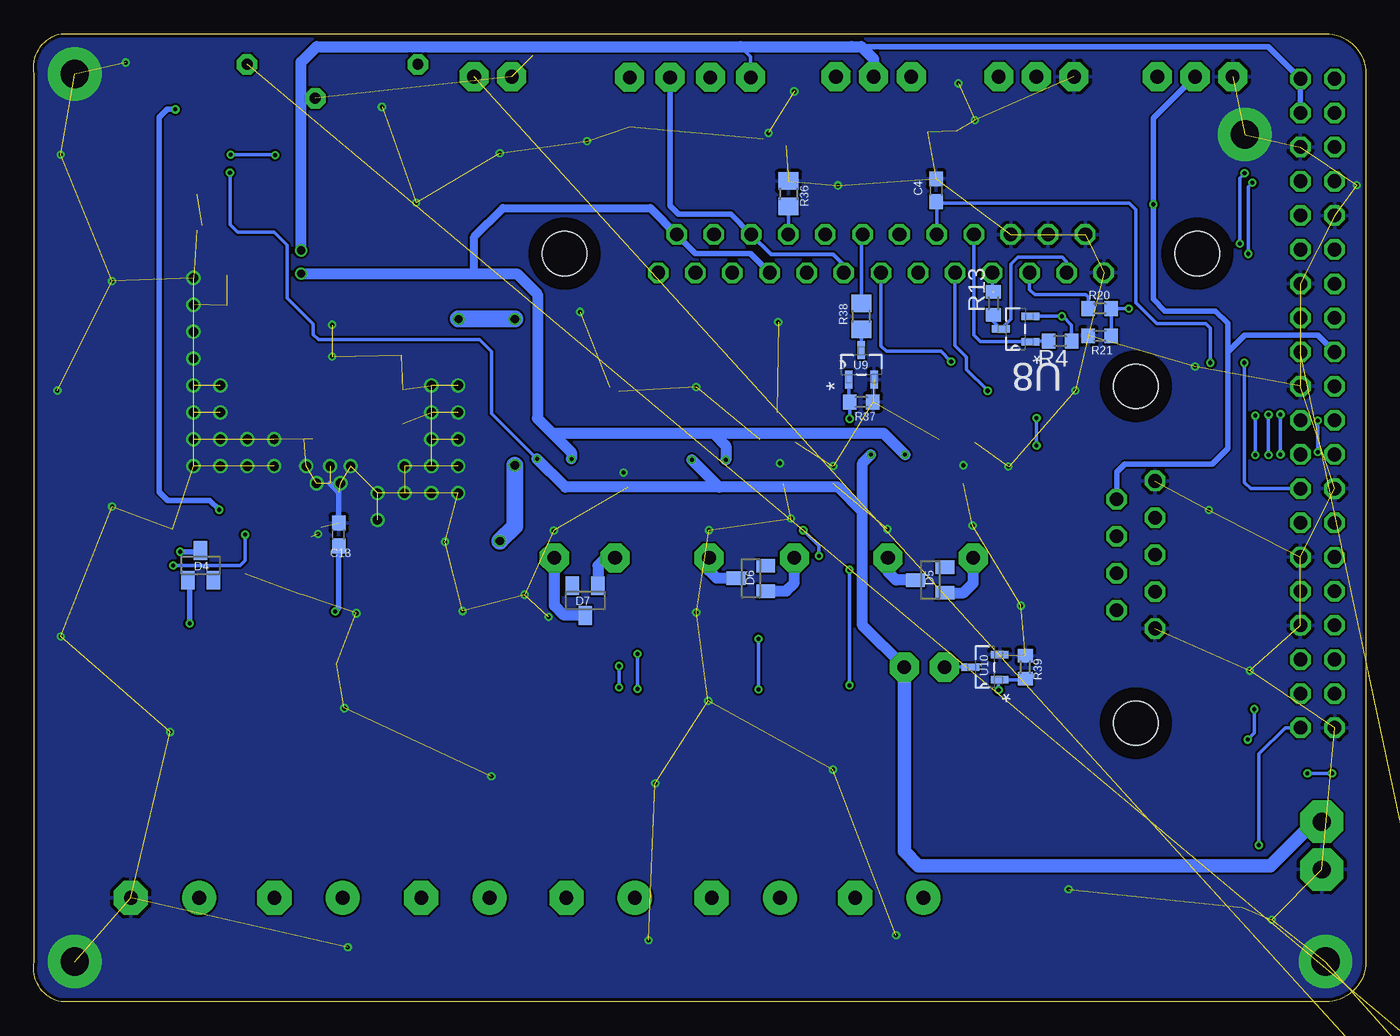
[diagram p6: board, bottom side, seen from below]

Size 99.05 x 72 mm. Coordinates in mm from the lower left corner, seen from the top.
Outline: 0,69 0,3 arc90 3,0 97,0 arc90 99,3 99,69 arc90 97,72 3,72 arc90 0,69
Copper layers (1*16): Top 0.035mm / dielectric 1.5mm / Bottom 0.035mm
Design rules "SeeedStudio_2layer_DRU *": minimum track width 6mil, minimum drill 12mil, track to track 6mil, track to pad 6mil, pad to pad 6mil, via to via 6mil, smd to smd 0mil, copper to edge 10mil, drill to drill 10mil, minimum pad ring 10mil, minimum via ring 6mil, stop-mask expansion 2mil, vias tented up to drill 1.5mm, thermal gap 10mil

### Footprints (pad centres in the part's own frame; a part is rotated, then mirrored left to right if it is on the bottom)
2,15/1,0 = drill 1.016 pad 2.159 octagon: 1 0,0
C0805 = smd 1.3 x 1.5: 1 -0.95,0; 2 0.95,0
E5-10,5 = drill 1.016 pad 2.54: + -2.54,0 | drill 1.016 pad 2.54 octagon: - 2.54,0
C0603 = smd 1.1 x 1: 1 -0.85,0; 2 0.85,0
D/7343-31W = smd 2.95 x 2.7: + 3.375,0; - -3.375,0
SOT23 = smd 1 x 1.4: 1 -0.95,-1.1; 2 0.95,-1.1; 3 0,1.1
R0805 = smd 1.3 x 1.5: 1 -0.95,0; 2 0.95,0
3,17/1,3 = drill 1.321 pad 3.175 octagon: 1 0,0
R0603 = smd 1 x 1.1: 1 -0.85,0; 2 0.85,0
PT-SPIN = drill 0.813 pad 1.524 octagon: 1 -6.35,-1.27; 2 6.35,-1.27; 3 -1.27,1.27
SM_5 = smd 4.5 x 3.4: P$1 -5.5,0; P$2 5.5,0
6530 = smd 1.85 x 3.4: P$1 -2.775,0; P$2 2.775,0
MA20-2 = drill 1.016 octagon: 1 -24.13,-1.27; 2 -24.13,1.27; 3 -21.59,-1.27; 4 -21.59,1.27; 5 -19.05,-1.27; 6 -19.05,1.27; 7 -16.51,-1.27; 8 -16.51,1.27; 9 -13.97,-1.27; 10 -13.97,1.27; 11 -11.43,-1.27; 12 -11.43,1.27; 13 -8.89,-1.27; 14 -8.89,1.27; 15 -6.35,-1.27; 16 -6.35,1.27; 17 -3.81,-1.27; 18 -3.81,1.27; 19 -1.27,-1.27; 20 -1.27,1.27; 21 1.27,-1.27; 22 1.27,1.27; 23 3.81,-1.27; 24 3.81,1.27; 25 6.35,-1.27; 26 6.35,1.27; 27 8.89,-1.27; 28 8.89,1.27; 29 11.43,-1.27; 30 11.43,1.27; 31 13.97,-1.27; 32 13.97,1.27; 33 16.51,-1.27; 34 16.51,1.27; 35 19.05,-1.27; 36 19.05,1.27; 37 21.59,-1.27; 38 21.59,1.27; 39 24.13,-1.27; 40 24.13,1.27
SOT23-BEC = smd 1 x 1.4: B -0.95,-1.1; C 0,1.1; E 0.95,-1.1
SOT150P400X160-4N = smd 0.8 x 1.4: 1 -1.499,-1.981; 3 1.499,-1.981 | smd 0.8 x 1.9: 2 0,-1.727 | smd 2.032 x 3.65: 4 0,0.94
SOT95P240X112-3N = smd 1.321 x 0.559: 1 -1.092,0.94; 2 -1.092,-0.94; 3 1.092,0
SOIC127P600X175-8N = smd 1.981 x 0.559: 1-GND -2.464,1.905; 2-TRIG -2.464,0.635; 3-OUT -2.464,-0.635; 4-RESET -2.464,-1.905; 5-CONT 2.464,-1.905; 6-THR 2.464,-0.635; 7-DIS 2.464,0.635; 8-VDD 2.464,1.905
HTSSOP-14 = smd 0.35 x 1.6: P$1 -1.95,-2.66; P$2 -1.3,-2.66; P$3 -0.65,-2.66; P$4 0,-2.66; P$5 0.65,-2.66; P$6 1.3,-2.66; P$7 1.95,-2.66; P$8 1.95,2.66; P$9 1.3,2.66; P$10 0.65,2.66; P$11 0,2.66; P$12 -0.65,2.66; P$13 -1.3,2.66; P$14 -1.95,2.66 | smd 2.31 x 2.46: P$15 0,0
F09V = drill 1.016 octagon: 1 5.486,1.422; 2 2.743,1.422; 3 0,1.422; 4 -2.743,1.422; 5 -5.486,1.422; 6 4.115,-1.422; 7 1.372,-1.422; 8 -1.372,-1.422; 9 -4.115,-1.422 | hole 3.302: -12.522,0; 12.522,0
F25V = drill 1.016 octagon: 1 16.561,1.422; 2 13.792,1.422; 3 11.049,1.422; 4 8.28,1.422; 5 5.512,1.422; 6 2.769,1.422; 7 0,1.422; 8 -2.769,1.422; 9 -5.512,1.422; 10 -8.28,1.422; 11 -11.049,1.422; 12 -13.792,1.422; 13 -16.561,1.422; 14 15.189,-1.422; 15 12.421,-1.422; 16 9.652,-1.422; 17 6.909,-1.422; 18 4.14,-1.422; 19 1.372,-1.422; 20 -1.372,-1.422; 21 -4.14,-1.422; 22 -6.909,-1.422; 23 -9.652,-1.422; 24 -12.421,-1.422; 25 -15.189,-1.422 | hole 3.302: 23.52,0; -23.52,0

### Placement (x,y rotation side)
BUZZER+  34.32,24.89 0 top
BUZZER-  31.32,24.89 0 top
C1  44.72,43.81 180 top
C2  35.43,7.75 0 top
C3  46.1,7.75 0 top
C4  31.95,60.35 90 bottom
C5  79.88,25.15 0 top
C6  83.33,32.71 270 top
C7  31.41,43.81 180 top
C8  56.78,43.5 180 top
C9  72.56,45.55 180 top
C10  72.56,43.01 180 top
C11  72.56,48.09 180 top
C12  56.9,7.75 0 top
C13  67.69,7.75 0 top
C14  78.61,7.75 0 top
C15  89.28,7.75 0 top
C16  -9.91,-25.15 0 top  (outside the outline)
C17  -9.91,-20.32 0 top  (outside the outline)
C18  76.37,34.76 90 bottom
C19  78.28,33.49 0 top
C20  73.2,30.31 0 top
C21  76.12,45.55 90 top
C22  83.74,54.06 0 top
C23  83.74,51.77 0 top
D1  12.17,12.38 270 top
D2  30.58,20.7 0 top
D3  9.31,16.26 0 top
D4  86.63,32.46 0 bottom
D5  32.38,31.37 90 bottom
D6  45.72,31.5 90 bottom
D7  58.04,29.84 180 bottom
D-5V  47.57,37.46 270 top
D-12V  50.11,37.46 270 top
DEHUM_SWITCH+  48.84,33.02 180 top
DEHUM_SWITCH_GND  42.49,33.02 180 top
DHT-EXT_3V3  24.5,68.8 180 top
DHT-EXT_GND  21.7,68.8 180 top
DHT-EXT_SIG  27.3,68.8 180 top
DHT-INT_3V3  12.7,68.8 180 top
DHT-INT_GND  9.9,68.8 180 top
DHT-INT_SIG  15.5,68.8 180 top
F-5V  59.07,37.46 270 top
F-12V  61.61,37.46 270 top
FAN_SWITCH+  60.34,33.02 180 top
FAN_SWITCH_GND  55.83,33.02 180 top
H-5V  34.27,37.78 270 top
H-12V  36.81,37.78 270 top
HEAT_SWITCH+  35.54,33.02 180 top
HEAT_SWITCH_GND  29.19,33.02 180 top
LIGHTSEN_3V3  63.5,68.8 180 top
LIGHTSEN_SIG  66.3,68.8 180 top
OPTSEN-EMIT_5V  45.74,68.75 0 top
OPTSEN-EMIT_GND  48.74,68.75 0 top
OPTSEN-REC_3V3  51.74,68.75 0 top
OPTSEN-REC_STATE  54.74,68.75 0 top
POWER+  3.28,13.4 0 top
POWER-  3.28,9.84 0 top
R1  30.45,65.6 90 top
R2  9.19,11.01 90 top
R3  9.19,7.89 90 top
R4  22.73,49.15 180 bottom
R5  -11.05,-29.97 0 top  (outside the outline)
R6  88.79,26.87 90 top
R7  86.23,26.87 270 top
R8  83.47,58.62 90 top
R9  14.01,66.72 0 top
R10  25.41,66.52 0 top
R11  54.73,65.94 90 top
R12  76.83,68.45 180 top
R13  27.69,51.94 90 bottom
R14  -11.05,-15.49 0 top  (outside the outline)
R15  48.74,65.53 90 top
R16  43.01,64.62 270 top
R17  82.38,35.89 0 top
R18  88.19,63.86 90 top
R19  78.3,58.8 270 top
R20  19.79,51.56 180 bottom
R21  19.79,49.53 0 bottom
R24  27.38,44.16 0 top
R25  28.23,41.59 0 top
R26  31.73,40.96 90 top
R27  31.73,46.04 180 top
R28  53.61,40.96 90 top
R29  56.78,40.64 90 top
R30  57.1,45.72 180 top
R31  53.68,45.24 90 top
R32  80.82,31.58 90 top
R34  73.2,32.47 180 top
R35  78.28,30.31 180 top
R36  42.93,60.09 270 bottom
R37  37.51,44.61 0 bottom
R38  37.51,50.98 90 bottom
R39  25.32,24.89 270 bottom
R40  41.54,45.08 90 top
R41  41.54,41.59 0 top
R42  45.03,40.96 90 top
R43  45.03,46.04 180 top
SERVO_5V  36.6,68.8 0 top
SERVO_GND  33.8,68.8 0 top
SERVO_PWM  39.4,68.8 0 top
SMW5-1  22.01,12.74 0 top
SMW5-2  22.01,4.23 0 top
SPM6530-1  80.82,46.95 90 top
SV1  3.59,44.51 270 top
T1  85.6,63.94 180 top
T2  86.91,58.34 180 top
T3  80.87,59.05 0 top
T4  -10.16,-9.65 0 top  (outside the outline)
U1  33.68,65.6 0 top
U2  86.82,32.71 270 top
U3  45.93,64.62 0 top
U4  27.5,37.46 270 top
U5  30.88,37.46 270 top
U6  55.83,37.15 270 top
U7  77.01,39.2 0 top
U8  26.04,50.04 180 bottom
U9  37.51,47.38 90 bottom
U10  28.32,24.89 180 bottom
U11  40.58,37.46 270 top
U12  44.23,37.46 270 top
X2  17.1,33.25 90 top
X3  36.05,55.65 180 top

### Tracks (layer width: path | path; a pad name or v marks a point on that pad's centre or on a via)
+3V3  (via drill 0.3)  (2 unrouted)
  Top 0.254: X3.17 29.14,58.66 28.5,59.3 v15.8,59.3 | R10.1 24.5,66.58 DHT-EXT_3V3.1 | R9.1 13.15,68.34 DHT-INT_3V3.1
  Top 0.305: X3.23 45.7,56.28 46.38,55.6 48.47,55.6 X3.12
  Top 0.406: SV1.1 2.32,69.91 2.77,70.36 12.2,70.36 | 12.2,70.36 23.6,70.36 | 23.6,70.36 50.12,70.36 | 50.12,70.36 OPTSEN-REC_3V3.1 | DHT-EXT_3V3.1 24.5,69.46 23.6,70.36 | DHT-INT_3V3.1 12.7,69.86 12.2,70.36 | 50.12,70.36 61.94,70.36
  Bottom 0.254: R4.2 24.89,49.15 U8.1 28.65,49.1 29.14,49.59 X3.17
  Bottom 0.305: X3.8 38.82,54.8 39.6,55.58 44.21,55.58 X3.23
  Bottom 0.406: OPTSEN-REC_3V3.1 51.74,59.2 51.1,58.57 47.21,58.57 X3.23 | X2.6 18.52,39.41 17.93,40.01 11.4,40.01 10.26,41.15 10.26,48.34 | 10.26,48.34 9.02,49.58 3.58,49.58 SV1.17 | 10.26,48.34 10.26,50.47 11.18,51.38 14.94,51.38 15.8,52.25 v15.8,59.3 15.8,65.7 DHT-INT_3V3.1
+5V  (via drill 0.3, 0.6)  (1 unrouted)
  Top 0.254: R34.2 71.08,32.47 70.66,32.89
  Top 0.406: U7.P$1 75.06,35.35 73.83,34.12 71.93,34.12 70.66,35.39 69.39,35.39 | 69.39,35.39 66.21,35.39 64.94,36.66 64.94,52.45 65.86,53.36 75.1,53.36 77.08,51.38 79.17,51.38 | C20.1 71.29,30.31 70.66,30.95 70.66,32.89 70.66,34.12 69.39,35.39 | X3.4 27.77,54.9 28.4,55.52 32.66,55.52 | 32.66,55.52 33.28,54.91 X3.6 | 32.66,55.52 34.21,57.07 X3.19 34.68,57.92 35.28,58.52 39.67,58.52 40.19,58.01 X3.21 41.66,55.6 42.95,55.6 X3.10
  Top 0.61: D-5V.1 v47.57,40.31 | F-5V.1 v59.07,40.37 | H-5V.1 v34.27,40.69
  Bottom 0.254: OPTSEN-EMIT_5V.1 45.74,70.3 46.48,71.04 | 27.77,52.88 X3.4
  Bottom 0.406: X3.10 45.76,55.65 49.82,55.65 X3.25 | SV1.4 SV1.2 7.26,71.04 38.23,71.04
  Bottom 0.61: 66.29,54.15 66.29,56.9 64.16,59.03 53.2,59.03 X3.25
  Bottom 0.813: v79.17,55.88 79.17,69.88 78,71.04 46.48,71.04 38.23,71.04 37.52,71.04 36.6,70.13 SERVO_5V.1 | v79.17,54.15 66.29,54.15 63.12,54.15 61.59,52.63 61.59,43.38 60.5,42.29 | 60.5,42.29 48.51,42.29 | 48.51,42.29 35.87,42.29 v34.27,40.69 | 48.51,42.29 47.57,41.35 v47.57,40.31 | 60.5,42.29 59.07,40.85 v59.07,40.37
  pour Top (rank 2, no thermals): 78.4,48.73 83.48,48.73 83.48,56.6 78.4,56.6
+12V  (via drill 0.3)
  Top 0.254: R2.2 9.2,13.26 9.27,13.33 | T2.3 85.41,61.22 84.96,61.67 v84.45,61.67
  Top 0.406: v36.8,40.69 v36.81,40.69 | v50.11,40.31 | v61.62,40.39 61.61,40.37
  Top 0.61: v36.81,40.69 H-12V.1 | v50.11,40.31 D-12V.1 | 61.61,40.37 F-12V.1
  Top 1.27: D1.1 9.27,13.33 8.36,13.33 | 8.36,13.33 3.34,13.33 POWER+.1 | D3.1 8.36,13.34 8.36,13.33
  Bottom 0.254: v84.45,61.67 84.45,57.81 83.9,57.25 81.18,57.25 80.21,56.29 80.21,52.35 78.26,50.39 78.26,49.63 77.88,49.25 65.89,49.25 65,48.36 65,43.76 v61.62,40.39
  Bottom 0.813: BUZZER+.1 37.41,27.99 37.41,36.47 | 37.41,36.47 37.41,40.08 v36.8,40.69 | 37.41,36.47 39.22,38.28 48.08,38.28 | 48.08,38.28 v50.11,40.31 | 48.08,38.28 59.51,38.28 v61.62,40.39
  Bottom 1.016: POWER+.1 3.85,13.4 7.11,10.13 33.25,10.13 34.32,11.2 BUZZER+.1
BUZZER  (via drill 0.3)
  Top 0.254: v27.3,23.19 27.3,22.78 26.09,21.57 26.09,18.95 24.31,17.17 13.74,17.17 12.01,18.9 8.23,18.9 5.64,16.31 3.86,16.31 3.38,16.79 3.38,20.85 2.32,21.91 SV1.37
  Bottom 0.254: R39.2 25.41,23.95 U10.1 27.3,23.95 v27.3,23.19
DEHUM_GND
  Top 0.254: U11.3 40.58,40.09 39.74,40.93 39.74,43.52 40.35,44.13 R40.1
  Top 0.813: U11.3 40.58,34.94 DEHUM_SWITCH_GND.1 44.23,34.76 U12.3
  Bottom 0.813: D6.1 43.11,30.55 42.49,31.17 DEHUM_SWITCH_GND.1
DEHUM_LED
  Top 0.254: R40.2 41.54,54.2 X3.9
DEHUM_LEVER_F  (via drill 0.3)
  Top 0.254: R43.1 45.88,44.03 C1.1 46.05,43.43 46.05,40.44 45.72,40.11 R42.1 45.17,39.97 U12.1 45.17,27.01 v45.16,27 | SV1.32 3.81,29.49 1.27,29.49 0.64,28.85 0.64,16.43 1.27,15.8 5.84,15.8 8.46,18.41 11.71,18.41 13.41,16.71 24.59,16.71 26.57,18.69 26.57,21.41 28.07,22.91 45.03,22.91 45.16,23.04 v45.16,23.24
  Top 0.406: 45.02,40.09 R42.1
  Bottom 0.254: v45.16,23.24 v45.16,27
DEHUM_LEVER_IN
  Top 0.254: R43.2 44.18,47.41 47.1,50.33 X3.11
DEHUM_SWITCH  (via drill 0.3)
  Top 0.254: 41.85,35.09 v41.83,35.08 41.52,35.4 U11.1 41.52,39.97 40.69,40.79 R41.1 | v40.66,33.17 40.66,31.93 40.21,31.47 27.94,31.47 26.7,32.72 26.7,34.98 26.09,35.59 25.65,35.59 25.09,36.14 25.09,40.59 25.88,41.38 25.88,42.06 25.76,42.19 1.29,42.19 0.64,41.53 0.64,32.23 SV1.31
  Bottom 0.254: v41.83,35.08 40.66,33.91 v40.66,33.17
DHT22_EXT
  Top 0.254: SV1.11 3.81,57.43 6.04,57.43 13.56,64.95 25.58,64.95 26.26,65.63 R10.2 26.9,66.52 27.3,66.92 DHT-EXT_SIG.1
DHT22_INT
  Top 0.254: SV1.7 1.69,61.02 1.25,61.47 1.25,67.06 1.5,67.31 11.68,67.31 12.06,66.93 12.06,66.04 12.45,65.66 14.61,65.66 14.86,65.91 R9.2 15.5,67.36 DHT-INT_SIG.1
ENABLE
  Top 0.406: 80.12,37.3 89.07,37.3 89.71,37.93 89.71,66.8 89.07,67.43 83.58,67.43 82.67,66.52 82.67,62.05 82.16,61.54 81.25,61.54 80.87,61.16 T3.C | R17.1 80.12,37.3 | U7.P$7 79.71,37.3 80.12,37.3
FAN_GND
  Top 0.406: U6.3 54.06,36.05 53.61,36.51 R28.1
  Top 0.813: U6.3 FAN_SWITCH_GND.1
  Bottom 0.813: FAN_SWITCH_GND.1 56.52,33.02 57.09,32.45 D7.1
FAN_LED
  Top 0.254: R28.2 53.61,42.81 53.39,43.03 52.88,43.03 52.43,43.48 52.43,46.91 54.3,48.79 54.3,52.53 X3.13
FAN_LEVER_F  (via drill 0.3)
  Top 0.254: R31.1 54.57,44.39 54.86,44.68 54.86,46.25 55.24,46.63 57.63,46.63 57.95,46.32 R30.1 57.95,43.71 C8.1 57.73,24.3 56.82,23.39 v55.52,23.39 | SV1.35 3.4,24.38 3.4,22.2 4.17,21.44 7.11,21.44 7.57,20.98 12.98,20.98 13.51,21.51 13.51,22.94 14.76,24.18 19.81,24.18 20.6,23.39 20.6,18.82 20.85,18.57 23.72,18.57 24.64,19.48 24.64,23.34 26.16,24.87 28.57,24.87 28.98,25.27 28.98,25.96 29.84,26.82 36.12,26.82 37.97,24.97 v55.52,24.97
  Bottom 0.254: v55.52,23.39 v55.52,24.97
FAN_LEVER_IN
  Top 0.254: X3.24 49.66,55.88 54,55.88 54.76,55.12 54.76,47.9 53.68,46.83 R31.2
FAN_SWITCH  (via drill 0.3)
  Top 0.254: R29.1 56.77,39.78 U6.1 56.77,34.95 57.28,34.44 57.28,24.61 56.9,24.23 36.91,24.23 36.27,24.87 36.27,26.01 35.92,26.36 30.02,26.36 29.41,25.76 29.41,24.77 29.11,24.46 26.42,24.46 25.12,23.16 25.12,19.3 23.93,18.11 20.45,18.11 20.12,18.44 20.12,23.16 19.56,23.72 14.99,23.72 13.99,22.73 13.99,20.55 13.77,20.32 8.74,20.32 5.41,16.99 v4.34,16.99 | v2.52,16.99 1.55,16.99 1.17,17.37 1.17,26.85 SV1.33
  Bottom 0.254: v4.34,16.99 v2.52,16.99
GND  (via drill 0.3, 0.7, 2.1 pad 4)  (139 unrouted)
  Top 0.254: R16.2 43.1,63.68 U3.2 44.84,64.2 v44.42,64.62 | 43.59,40.08 43.59,41.15 | 43.59,41.15 43.14,41.59 R41.2 | R42.2 44.24,41.81 43.59,41.15 | C1.2 43.59,43.63 43.59,41.15 | R25.2 29.92,40.75 | 29.92,40.75 v29.92,39.9 | R26.2 30.97,41.81 30.46,41.29 | 30.46,41.29 29.92,40.75 | C7.2 30.46,41.29
  Top 0.406: R29.2 55.73,41.49 | 55.73,41.49 55.19,40.96 v55.19,39.37 | 55.73,41.49 55.83,41.59 C8.2 55.51,43.82 55.51,45.4 55.83,45.72 R30.2 | R35.1 C19.2 79.13,34.22 78.78,34.56 78.4,34.56 77.66,35.31 U7.P$5 | T3.E 83.29,57.95 R8.1 86.54,57.77 T2.4
  Top 0.61: 43.59,40.08 v43.56,40.06 43.29,39.79 U12.2 | U4.2 26.56,39.79 v26.57,39.8 | U5.2 29.93,39.89 v29.92,39.9 | U11.2 39.64,39.81 v39.6,39.85
  Top 0.813: v55.19,39.37 54.89,39.06 U6.2
  Bottom 0.406: C18.2 76.37,37.93 77.01,38.57
  other vias: 87.17,39.84 87.17,41.84 87.17,43.84 87.17,45.84 87.17,47.84 87.17,49.84 87.17,51.84 87.17,53.84 78.02,38.57 77.01,39.84 76.24,38.57 75.48,39.84 78.78,39.84 73.48,35.84 73.48,37.84 71.48,37.84 71.48,39.84 69.48,37.84 69.48,39.84 67.48,37.84 67.48,39.84 67.48,41.84 69.48,41.84 69.48,43.84 67.48,43.84 69.48,45.84 67.48,45.84 85.17,39.84 85.17,41.84 83.17,39.84 83.17,41.84 81.17,39.84 81.17,41.84 85.17,43.84 85.17,45.84 29.06,65.56 77.9,34.8 57.91,64.01 64.39,63.12 70.61,59.44 73.15,66.55 92.2,69.85 97.03,62.99 93.22,53.59 97.28,45.47 93.22,36.83 97.03,27.18 88.9,20.07 75.95,21.84 65.02,16.76 75.69,4.06 53.34,4.57 52.83,16.26 34.92,4.95 39.62,17.27 6.99,6.1 22.1,8.38 25.65,29.46 11.68,36.58 49.78,28.96 49.78,45.72 43.69,50.55 58.42,51.31 12.7,47.24 21.59,45.47 8.64,24.64 96,69 96,3 3,3 9,64.5 75.06,28.91 67.16,29.06 68.45,34.21 62.56,30.28 60.76,28.63 48.9,22.38 76.86,50.34 76.86,47.98 0.69,60.73 29.24,35.43 35.56,35.15 42.75,35.94 48.84,35.08 60.38,35.05 42.5,67.7 30.3,68.3 39.24,60.71
  pour Top (isolate 0.254, rank 6, no thermals): 71.29,42.38 71.29,48.09 70.66,48.73 66.21,48.73 65.58,48.09 65.58,36.66 66.21,36.03 70.66,36.03 71.93,34.76 73.83,34.76 74.47,35.39 74.47,37.3 75.1,37.93 88.44,37.93 89.07,38.25 89.12,55.83 88.41,56.61 81.5,56.65 80.82,55.81 80.82,51.27 80.18,50.63 79.55,50.63 78.91,50 78.91,43.2 78.15,43.2 78.02,40.47 74.47,40.47 73.2,41.74 71.93,41.74
  pour Bottom (rank 6): 0,72.24 101.07,72.24 101.07,0 0,0
  pour Top (rank 6): 101.04,72.24 -0.03,72.24 -0.03,0 101.04,0
  pour Bottom (isolate 0.254, rank 6, no thermals): 71.29,42.38 71.29,48.09 70.66,48.73 66.21,48.73 65.58,48.09 65.58,36.66 66.21,36.03 70.66,36.03 71.93,34.76 73.83,34.76 74.47,35.39 74.47,37.3 75.1,37.93 88.44,37.93 89.07,38.25 89.12,55.83 88.41,56.61 81.5,56.65 80.82,55.81 80.82,51.27 80.18,50.63 79.55,50.63 78.91,50 78.91,43.2 78.15,43.2 78.02,40.47 74.47,40.47 73.2,41.74 71.93,41.74
HEAT_GND
  Top 0.406: U4.3 25.83,36.37 25.69,36.51 25.69,40.32 26.43,41.06 R24.1
  Top 0.813: U5.3 30.88,34.71 HEAT_SWITCH_GND.1 27.5,34.71 U4.3
  Bottom 0.813: D5.1 29.91,30.42 29.19,31.14 HEAT_SWITCH_GND.1
HEAT_LED  (via drill 0.3)
  Top 0.254: v28.12,45.44 28.12,44.37 R24.2
  Bottom 0.254: v28.12,45.44 29.69,47.02 29.69,47.95 30.54,48.8 X3.5
HEAT_LEVER_F  (via drill 0.3)
  Top 0.254: SV1.29 1.56,33.08 1.22,33.43 1.22,41.43 1.57,41.78 24.08,41.78 v24.49,41.38 | v24.49,43.41 24.49,43.51 24.92,43.94 24.92,45.41 26.31,46.81 29.16,46.81 29.79,46.18 29.79,45.52 30.25,45.06 32.58,45.06 | U5.1 31.82,40.02 R26.1
  Top 0.406: 31.71,40.09 R26.1 32.46,40.11 32.68,40.32 32.68,43.49 C7.1 32.58,43.81 32.58,45.06 R27.1
  Bottom 0.254: v24.49,41.38 v24.49,43.41
HEAT_LEVER_IN  (via drill 0.3)
  Top 0.254: R27.2 30.84,46.08 v30.84,47.62
  Bottom 0.254: v30.84,47.62 31.6,48.39 35.66,48.39 36.05,48.78 X3.7
HEAT_SWITCH
  Top 0.254: R25.1 27.38,40.54 28.44,39.48 U4.1 | 27.28,41.49 27.28,42.45 27.66,42.82 29.06,42.82 29.31,43.08 29.31,45.8 28.78,46.33 27.46,46.33 27.1,45.97 27.1,45.59 27.05,45.54 25.88,45.54 25.48,45.14 25.48,43.18 25.07,42.77 5.33,42.77 SV1.22
  Top 0.406: 27.28,41.49 R25.1
I2C_SCL  (via drill 0.3)
  Top 0.254: X2.3 14.53,33.25 13.72,32.44 13.72,29.97 13.49,29.74 8.64,29.74 8.43,29.95 8.43,38.63 7.24,39.83 v7.24,40.66 | v7.24,43.66 7.24,45.95 6.33,46.86 0.94,46.86 0.64,47.17 0.64,59.51 1.09,59.97 2.95,59.97 3.4,60.43 3.4,62.48 SV1.5
  Bottom 0.254: v7.24,40.66 v7.24,43.66
I2C_SDA  (via drill 0.3)
  Top 0.254: X2.2 15.68,34.96 15.27,34.54 14.05,34.54 13.28,33.78 13.28,30.61 12.85,30.18 9.02,30.18 8.89,30.3 8.89,38.91 8.23,39.57 v8.23,40.66 | v8.23,43.59 8.23,45.62 6.58,47.27 1.5,47.27 1.17,47.6 1.17,59.16 1.55,59.54 3.23,59.54 3.81,60.12 3.81,64.62 SV1.3
  Bottom 0.254: v8.23,40.66 v8.23,43.59
LED_ON_GND
  Bottom 0.254: R36.2 42.93,57.1 X3.22
LED_RUN  (via drill 0.3)
  Top 0.254: v38.38,43.36 38.38,32.16 v38.41,32.13 | SV1.36 3.81,24.41 3.81,22.43 4.37,21.87 8.2,21.87 v8.31,21.77 | v38.41,23.55 38.2,23.34 28.98,23.34 28.3,24.03 26.64,24.03 25.6,22.99 25.6,19.15 24.08,17.63 14.12,17.63 12.24,19.51 v8.79,19.51
  Bottom 0.254: U9.1 38.45,44.7 R37.1 38.36,43.38 v38.38,43.36 | v38.41,23.55 v38.41,32.13 | v8.31,21.77 8.31,19.99 v8.79,19.51
LED_RUN_GND
  Bottom 0.254: R38.2 37.51,56.98 X3.20
LIGHT_SENSOR  (2 unrouted)
  Top 0.254: SV1.18 5.5,48.32 6.71,49.53 6.71,54.74 14.2,62.23 35.15,62.23 37.44,64.52 40.87,64.52 41.12,64.26 41.12,62.99 41.88,62.23 49.51,62.23 50.65,63.37 50.65,65.53 51.03,65.91
LIGHT_SENSOR_UNFILTERED  (2 unrouted)
N$1
  Top 1.27: SMW5-1.P$2 27.51,7.75 | 27.51,7.75 SMW5-2.P$2 | SMW5-1.P$2 27.51,15.85 29.63,17.97 D2.1 | 27.57,12.68 SMW5-1.P$2 | C2.+ 27.51,7.75
N$2
  Top 1.27: C3.+ C2.-
N$3
  Top 1.27: C12.+ C3.-
N$4
  Top 1.27: SMW5-1.P$1 16.16,12.38 D1.3 13.27,5.76 14.8,4.23 SMW5-2.P$1
N$5  (via drill 0.3)
  Top 0.406: R6.1 R7.2 87.31,26.02 87.46,26.17 v87.46,28.14 U2.7-DIS
  Bottom 0.406: D4.1 87.46,31.23 v87.46,28.14
N$6  (via drill 0.3)
  Top 0.254: C5.+ 83.26,27 83.98,27.72 R7.1
  Top 0.406: U2.6-THR 86.19,31.76 87.46,33.03 87.46,33.47 | 87.46,33.47 U2.2-TRIG | U2.6-THR 86.12,30.18 | v88.16,33.47 87.46,33.47 | R7.1 86.19,27.76 U2.6-THR
  Bottom 0.406: D4.3 86.72,33.47 v88.16,33.47
N$7
  Top 0.406: SERVO_GND.1 33.8,66 34.2,65.6 U1.3
N$8
  Top 1.27: C13.+ C12.-
N$9
  Top 0.406: U2.5-CONT 84.92,32.9 84.26,33.56 C6.1
N$10
  Bottom 0.254: U10.3 BUZZER-.1
N$11
  Top 0.406: T2.1 88.41,61.23 88.19,61.45 R18.1 85.78,63.01 T1.C
N$12  (via drill 0.3)
  Top 0.406: R8.2 83.47,64.78 83.79,65.1 84.6,65.1 T1.E 84.65,66.11 84.91,66.37 v88.51,66.37 | U2.4-RESET 84.92,36.25 v85.26,36.6
  Bottom 0.406: v88.51,66.37 89.12,66.37 89.71,65.78 89.71,37.93 89.07,37.3 85.96,37.3 v85.26,36.6
N$14
  Top 0.254: R15.2 OPTSEN-EMIT_GND.1
N$15
  Top 0.254: U3.3 48.7,64.62 R15.1
N$16
  Top 0.406: R19.1 78.3,61.49 79.01,62.2 81.6,62.2 81.96,62.56 81.96,67.08 83.13,68.25 89.27,68.25 90.44,67.08 90.44,37.41 89.73,36.7 86.48,36.7 86.19,36.41 U2.3-OUT
N$17
  Top 0.406: R19.2 T3.B
N$18
  Top 1.27: C14.+ C13.-
N$19
  Top 1.27: C15.+ C14.-
N$20  (1 unrouted)
N$21  (2 unrouted)
N$22
  Top 0.813: F-12V.2 61.61,34.29 FAN_SWITCH+.1 59.07,34.29 F-5V.2
  Bottom 0.813: D7.3 59.61,28.75 60.34,29.48 FAN_SWITCH+.1
N$25
  Bottom 0.254: U9.3 R38.1
N$26
  Top 0.813: H-12V.2 36.81,34.29 HEAT_SWITCH+.1 34.27,34.29 H-5V.2
  Bottom 0.813: D5.3 34.92,31.37 35.54,31.98 HEAT_SWITCH+.1
N$27
  Top 0.813: D-12V.2 50.11,34.29 DEHUM_SWITCH+.1 47.57,34.29 D-5V.2
  Bottom 0.813: D6.3 48.26,31.5 48.84,32.08 DEHUM_SWITCH+.1
N$28  (via drill 0.3)
  Top 0.254: U7.P$3 76.36,32.91 77.06,32.21 77.85,32.21 78.28,31.77 78.28,29.03
  Top 0.406: R32.1 80.82,29.68 80.18,29.04 80.18,29.03 78.28,29.03 v76.62,29.03
  Bottom 0.406: v76.62,29.03 76.37,29.28 C18.1
N$30
  Top 0.406: R32.2 80.82,34.56 80.1,35.28 78.59,35.28 78.31,35.56 U7.P$6
N$31
  Top 0.406: C19.1 77.01,33.91 U7.P$4
N$34
  Top 0.254: R34.1 74.85,32.47 75.71,33.33
  Top 0.406: R35.2 76.37,30.31 75.71,30.98 75.71,31.14 | 75.71,31.14 75.71,33.33 U7.P$2 | C20.2 74.88,30.31 75.71,31.14
N$35
  Top 0.406: U7.P$12 76.36,42.96 76.12,43.2 C21.1
N$36
  pour Top (isolate 0.254, rank 3, no thermals): 76.88,40.92 76.88,44.98 75.86,44.98 75.86,46.19 76.62,46.95 83.1,46.69 83.1,43.26 77.64,43.2 77.64,40.92
OPTSEN_ON/OFF
  Top 0.254: U3.1 43.1,65.56 R16.1 37.13,65.47 34.9,63.25 13.95,63.25 5.31,54.61 4.17,54.61 3.53,53.98 3.53,51.69 2.71,50.86 SV1.15
OPTSEN_STATE
  Top 0.254: OPTSEN-REC_STATE.1 54.74,66.8 R11.2 51.02,66.8 50.14,65.91 50.14,63.5 49.38,62.74 42.01,62.74 41.63,63.12 41.63,64.77 41.38,65.02 37.31,65.02 35.03,62.74 14.07,62.74 6.2,54.86 6.2,51.82 5.25,50.86 SV1.16
POWER_STATE  (via drill 0.3)
  Top 0.254: R3.2 R2.1 8.25,10.16 7.95,10.46 v7.95,11.66
  Bottom 0.254: SV1.40 6.01,20.38 7.95,18.44 v7.95,11.66
RESET_LEVER  (via drill 0.3)
  Top 0.254: v9.04,47.52 v11.56,47.52
  Bottom 0.254: SV1.26 8.57,38.16 9.04,38.63 v9.04,47.52 | v11.56,47.52 11.56,50.11 11.89,50.44 15.54,50.44 17.09,51.99 17.09,58.89 17.6,59.4 31.85,59.4 C4.1 31.91,59.1 X3.18
SERVO_ON/OFF
  Top 0.254: U1.1 30.54,66.54 R1.2 28.71,66.45 28.3,66.04 28.3,65 27.82,64.52 13.82,64.52 6.33,57.02 4.17,57.02 3.53,56.39 3.53,55.12 2.32,53.91 SV1.13
SERVO_PWM
  Top 0.254: SV1.12 6.01,55.94 13.82,63.75 34.65,63.75 36.89,66 38.7,66 39.4,66.7 SERVO_PWM.1
SPI_CE0
  Top 0.254: SV1.24 7.47,38.1 7.47,29.01 7.75,28.73 13.9,28.73 X2.4
SPI_MISO  (via drill 0.3)
  Top 0.254: SV1.21 3.57,43.24 v3.58,43.23 | v3.58,40.89 3.58,40.21 4.57,39.22 5.69,39.22 7.01,37.9 7.01,28.65 7.42,28.25 14.22,28.25 14.94,28.96 16.92,28.96 17.32,29.36 17.32,30.68 X2.8
  Bottom 0.254: v3.58,43.23 v3.58,40.89
SPI_MOSI  (via drill 0.3)
  Top 0.254: X2.7 18.52,33.87 16.54,31.88 14.86,31.88 14.25,31.27 14.25,29.74 13.72,29.21 8.26,29.21 7.95,29.52 7.95,38.38 6.35,39.98 v6.35,40.72 | v6.35,43.69 5.74,44.3 3.81,44.3 SV1.19
  Bottom 0.254: v6.35,40.72 v6.35,43.69
SPI_SCLK
  Top 0.254: SV1.23 3.4,39.62 3.4,37.08 3.79,36.7 5.56,36.7 6.1,36.17 6.1,27.64 7.16,26.57 17.73,26.57 18.52,27.36 X2.9
UART_RX_3V3  (via drill 0.3)
  Top 0.254: v17.63,51.56 17.12,52.07 11.02,52.07 8.74,54.36 v8.74,55.63 | v8.43,60.91 6.3,60.91 5.99,60.6 5.99,59.61 SV1.10
  Bottom 0.254: R21.2 R20.1 v17.63,51.56 | v8.74,55.63 8.74,60.6 v8.43,60.91
UART_RX_5V
  Bottom 0.254: R20.2 20.64,52.41 20.8,52.58 24.61,52.58 25,52.97 X3.3
UART_TX_3V3  (via drill 0.3)
  Top 0.254: v9.37,56.39 9.37,54.48 11.28,52.58 21.95,52.58 22.61,51.92 v22.61,50.98 | v9.02,61.62 5.46,61.62 SV1.8
  Bottom 0.254: v9.37,56.39 9.37,61.27 v9.02,61.62 | R4.1 21.88,50.33 22.53,50.98 v22.61,50.98 22.99,50.98 U8.2
UART_TX_5V
  Bottom 0.254: X3.2 22.26,55.05 22.58,55.37 25.88,55.37 26.39,54.86 26.39,50.77 U8.3 27.69,50.6 R13.1
VCOND  (via drill 0.3, 0.6)
  Top 0.254: U2.8-VDD 88.73,32.39 v88.66,32.46 | R17.2 83.23,34.85 v83.33,34.74 82.09,34.74 81.71,34.37 81.71,29.69 80.06,28.04 64.49,28.04 64.39,28.14
  Top 0.406: U2.8-VDD 88.73,30.17 88.79,30.11 R6.2
  Top 1.27: v64.39,34.27 64.39,28.14 64.39,23.95 61.24,20.8 35.84,20.8 34.84,21.8 D2.3 28.38,21.8 27.66,21.08 27.66,18.36 24.87,15.57 12.93,15.57 11.14,17.36 D3.3 | v63.27,39.9 v63.27,50.77
  Bottom 0.254: v88.66,32.46 83.71,32.46 83.33,32.84 v83.33,34.74
  Bottom 1.27: v64.39,34.27 63.27,35.38 v63.27,39.9 | v63.27,50.77 v67.46,50.77
  pour Top (no thermals): 75.86,40.92 73.32,40.92 73.32,49.3 66.21,49.36 65.58,50 65.55,51.9 66.21,52.6 74.49,52.59 75.74,50.63
WATCHDOG  (via drill 0.3)
  Top 0.254: T1.B 85.92,65.04 85.62,64.75 85.62,64.24 85.32,63.93 84.63,63.93 84.4,63.7 v84.4,62.99 | v81.1,62.97 78.59,62.97 77.27,61.65 77.27,54.36 76.96,54.05 65.48,54.05 64.39,52.96 64.39,36.91 64.06,36.58 63.04,36.58 62.79,36.32 62.79,32 62.33,31.55 58.55,31.55 58.24,31.24 58.24,24.11 56.84,22.71 54.71,22.71 v54.15,23.27 | SV1.38 5.41,22.38 9.53,22.38 10.08,21.82 12.75,21.82 13.03,22.1 13.03,23.09 14.58,24.64 20.09,24.64 21.06,23.67 21.06,19.3 21.34,19.02 23.55,19.02 24.21,19.68 24.21,23.57 25.96,25.32 28.25,25.32 28.52,25.6 28.52,26.11 29.69,27.28 36.8,27.28 38.2,25.88 v54.15,25.88
  Top 0.406: T1.B 86.88,64.71 R18.2
  Bottom 0.254: v84.4,62.99 81.13,62.99 v81.1,62.97 | v54.15,23.27 v54.15,25.88

### Text on the board
tDocu: DHT-INT | DHT-EXT | SERVO | OPTICAL FORK | LIGHT SENSOR | - | + | SIG | - | + | SIG | - | + | PWM | + | EMIT | - | + | REC | SIG | + | SIG | T.MARION / 11-2016 | +5V | +12V | +5V | +5V | +12V | +12V | RevA | - | HEAT | + | - | DEHUM | + | - | FAN | + | BUZZER | - | + | + | +12V | + | - | + | - | + | - | POWER IN | GND